# EAGLE design main_board (EAGLE 9.6.2)

## Sheet 1 of 2
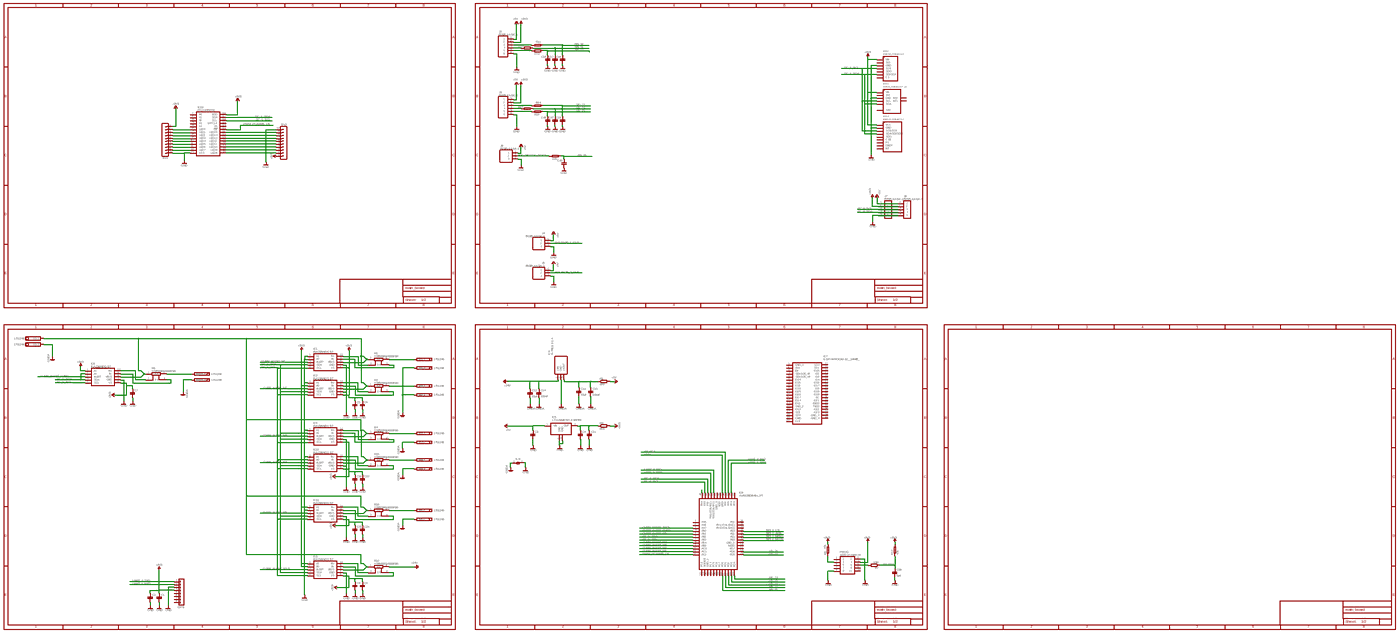
[diagram p0: schematic, sheet 1, overview]
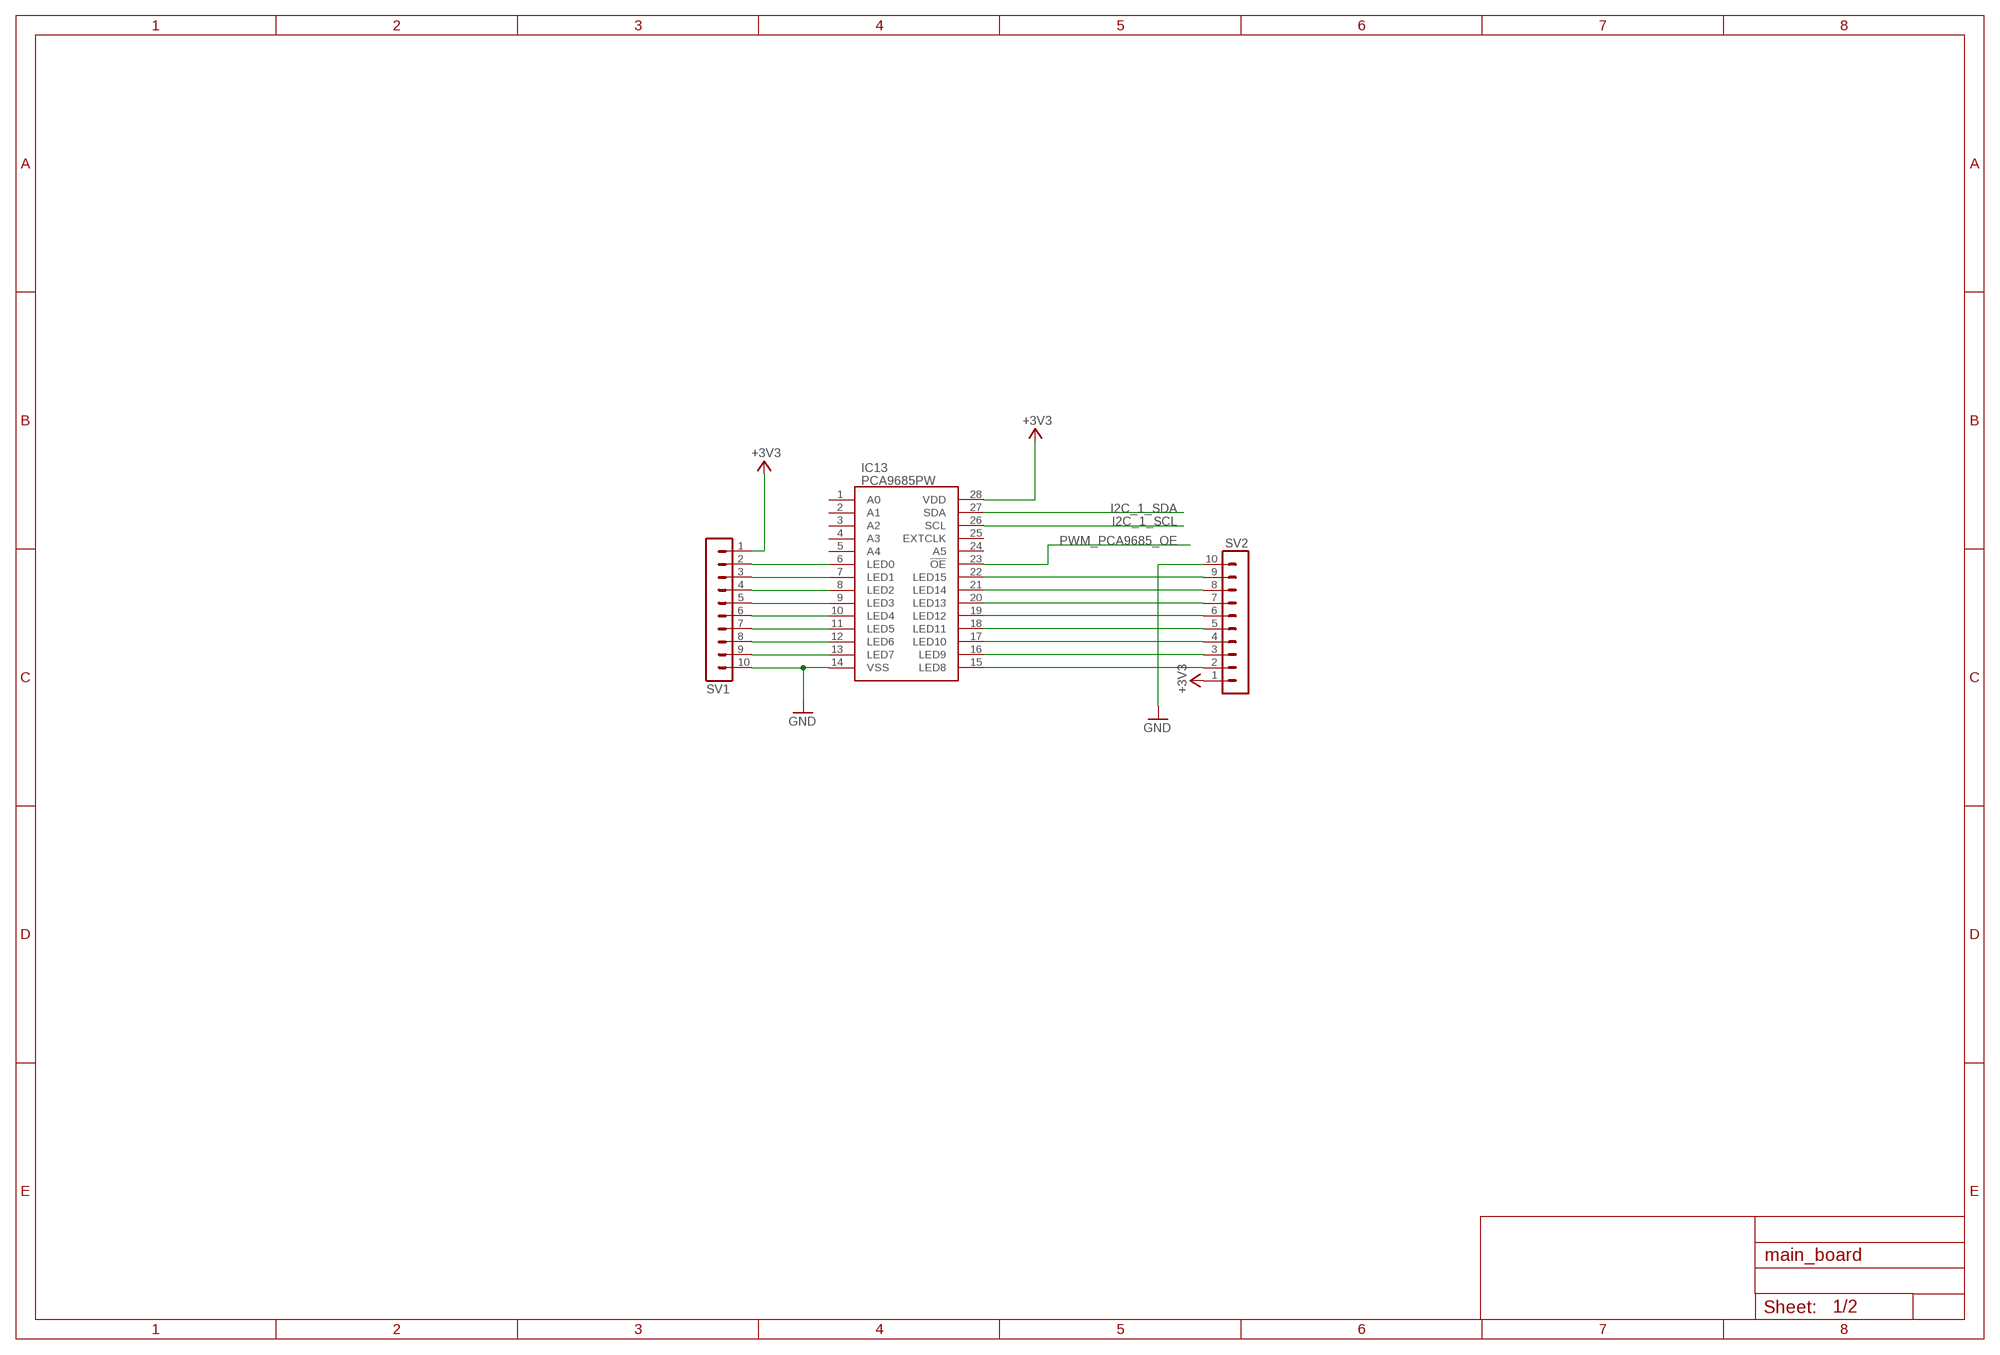
[diagram p1: schematic, sheet 1, part 1 of 7]
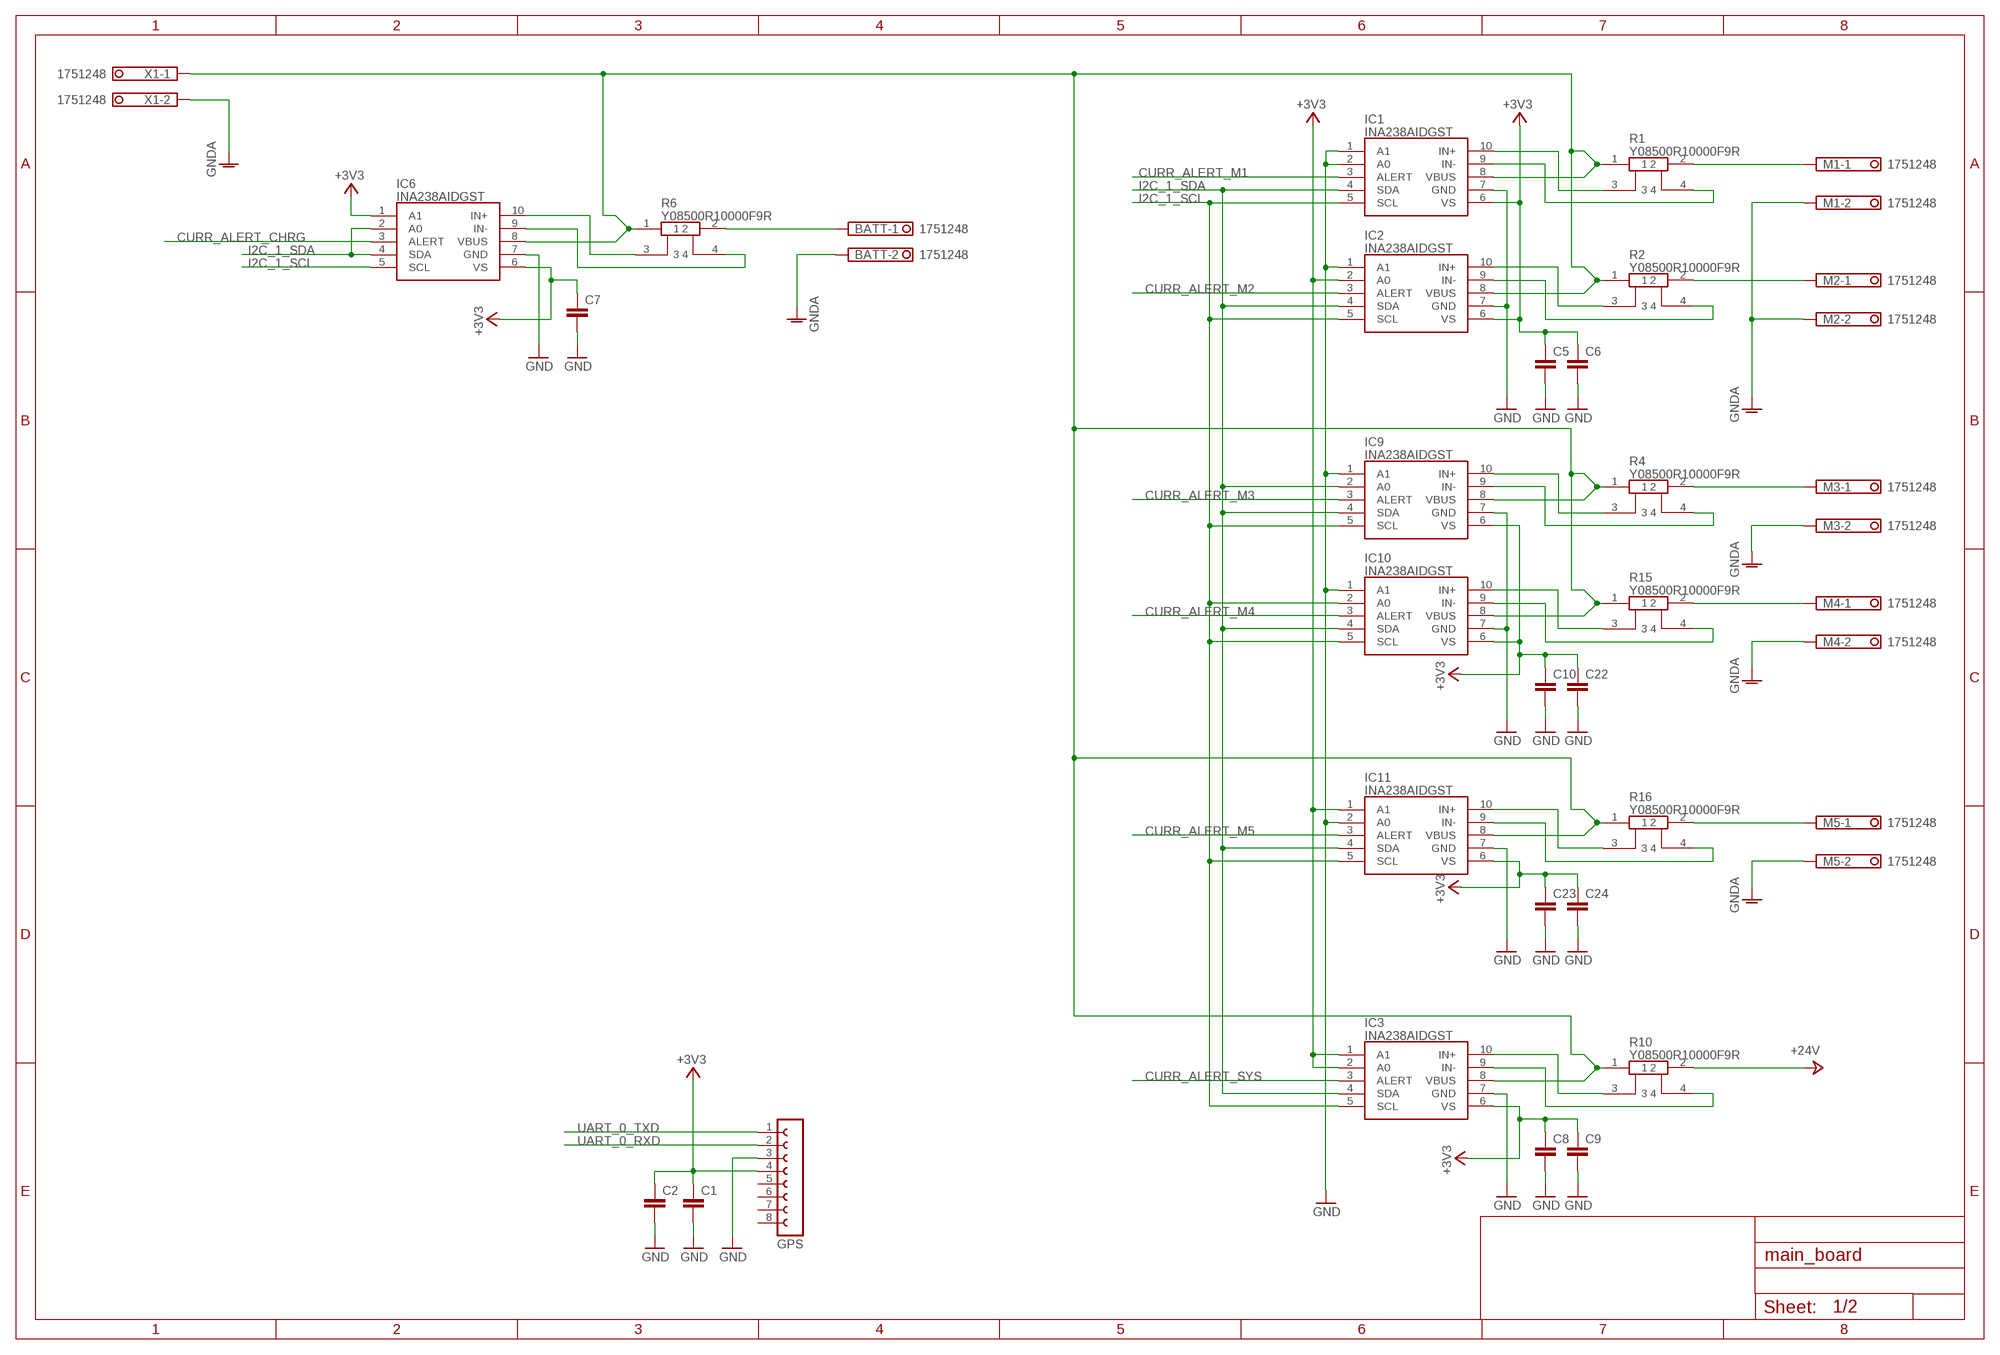
[diagram p2: schematic, sheet 1, part 2 of 7]
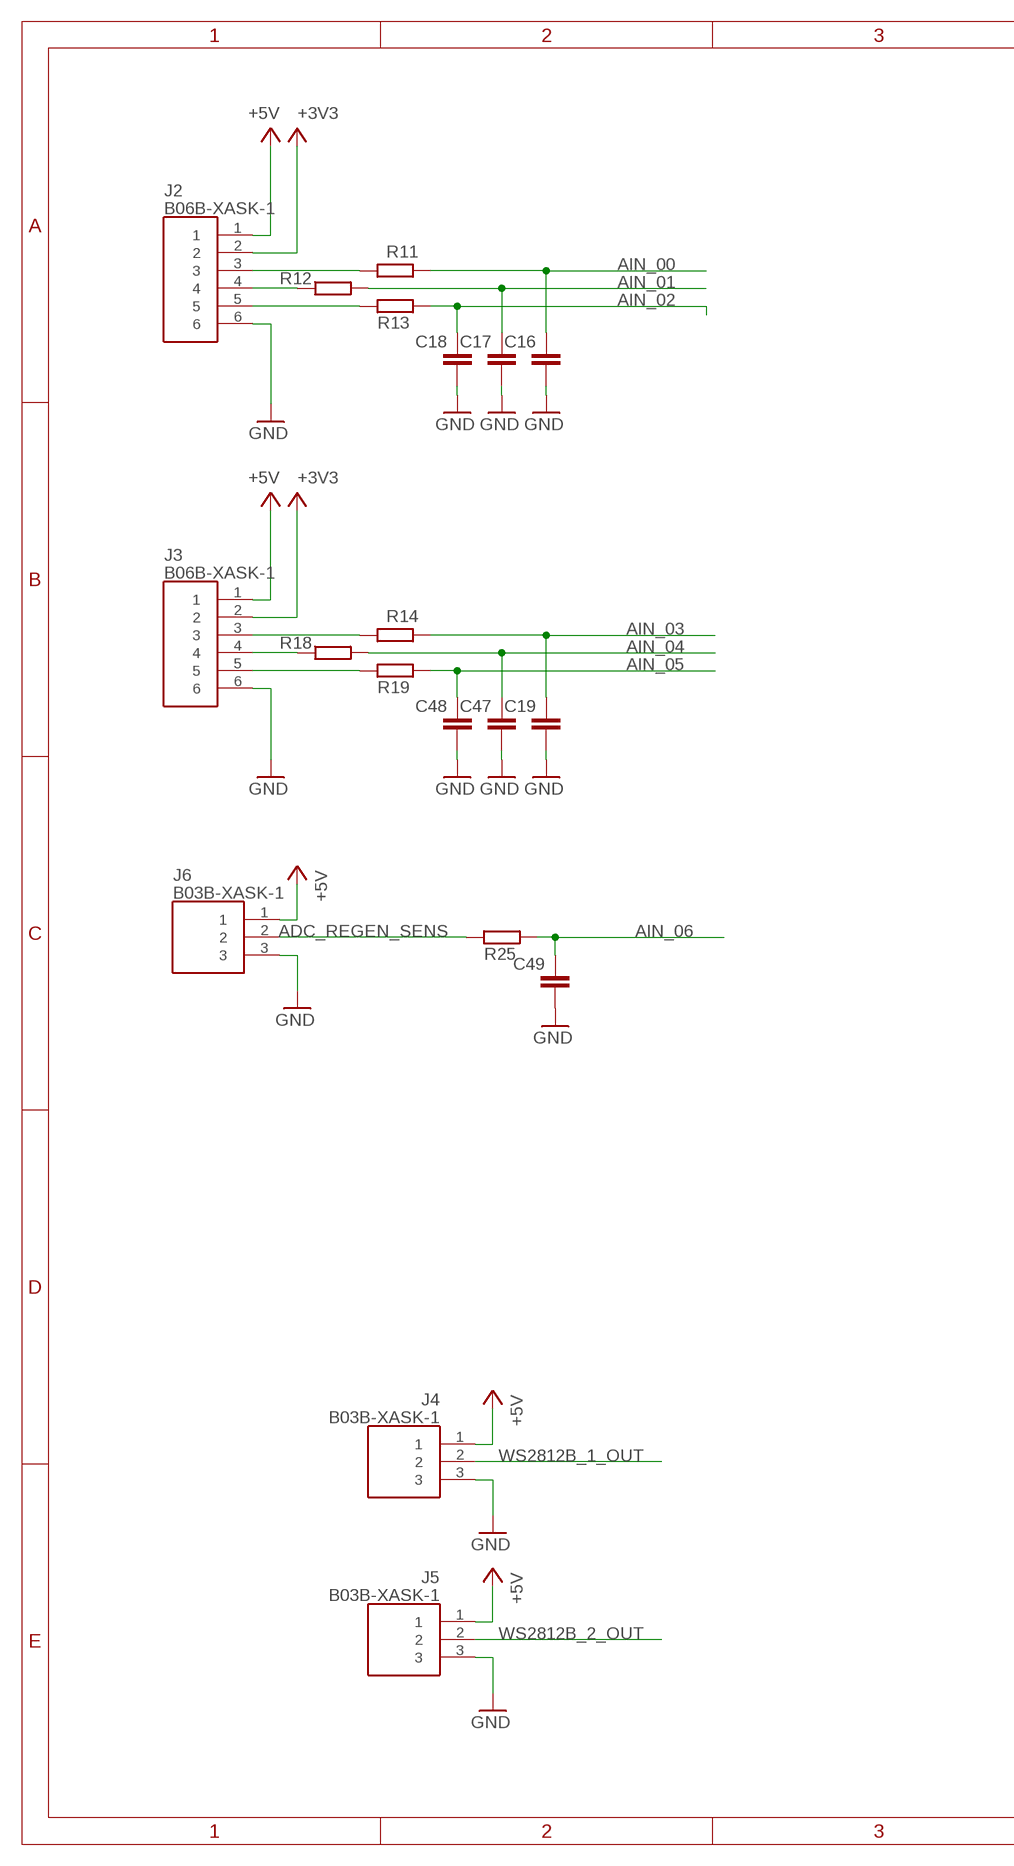
[diagram p3: schematic, sheet 1, part 3 of 7]
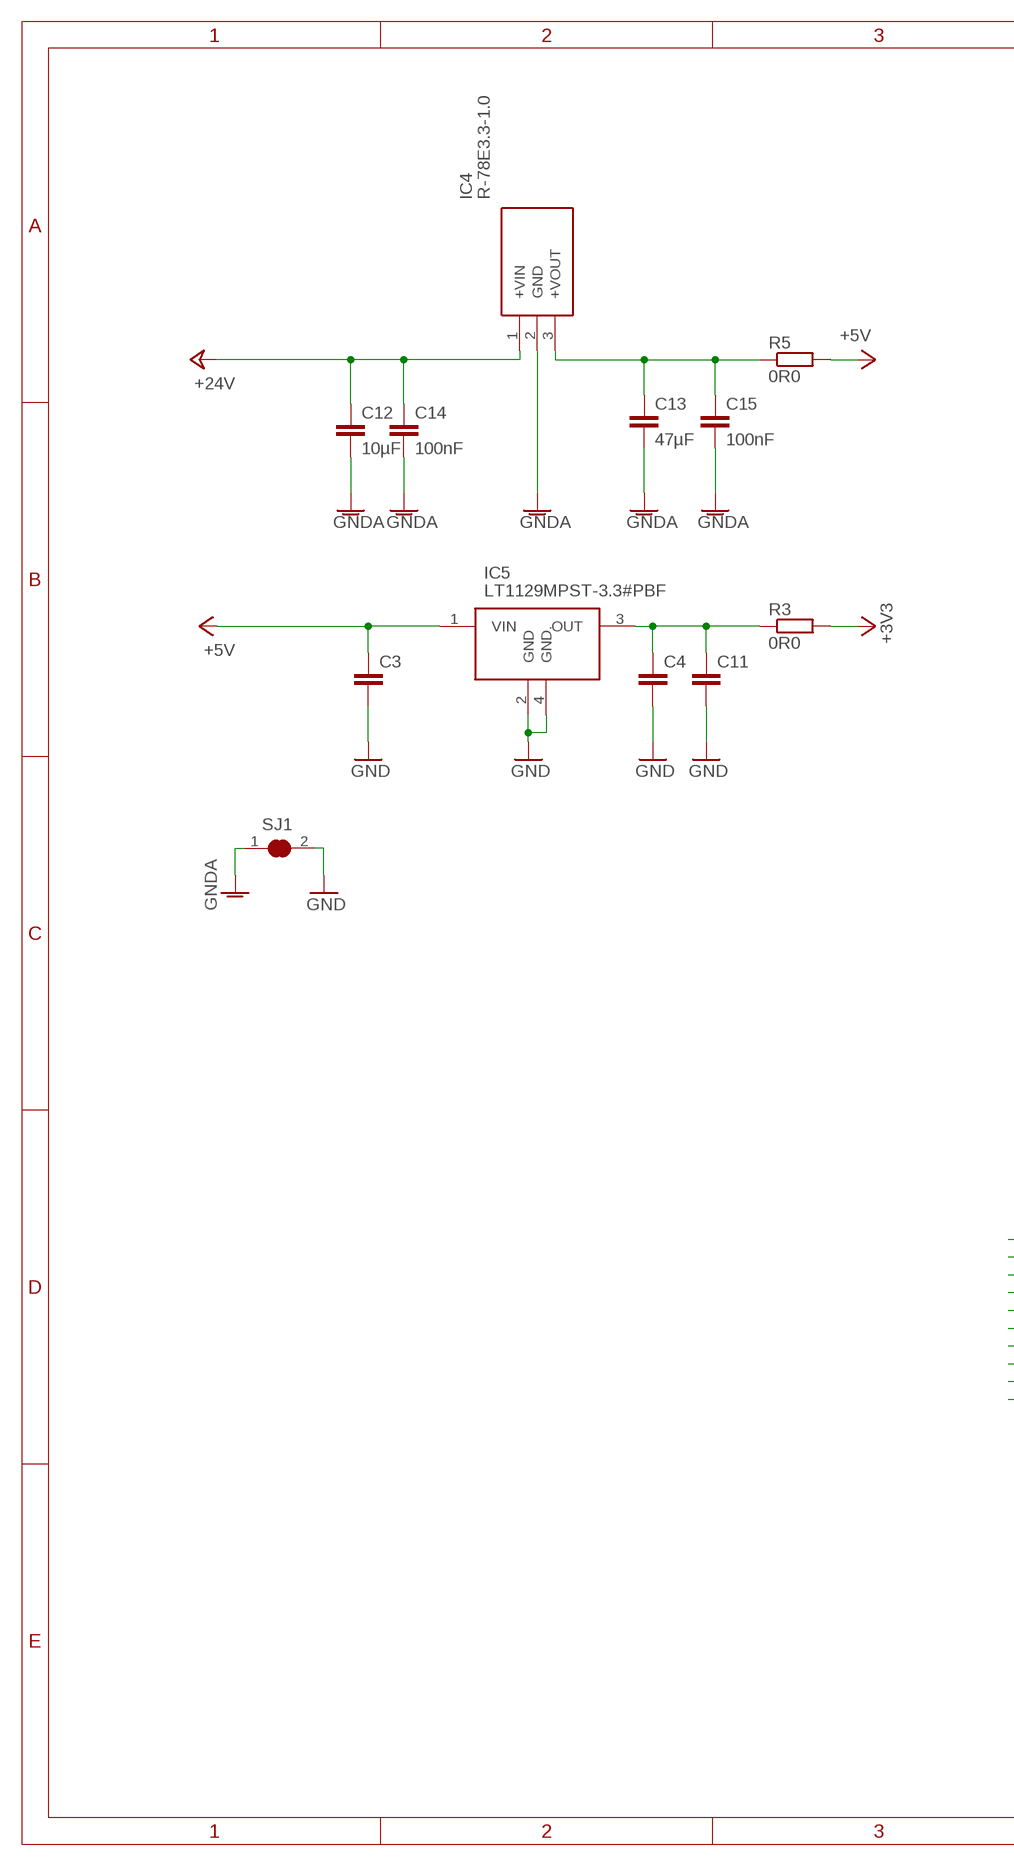
[diagram p4: schematic, sheet 1, part 4 of 7]
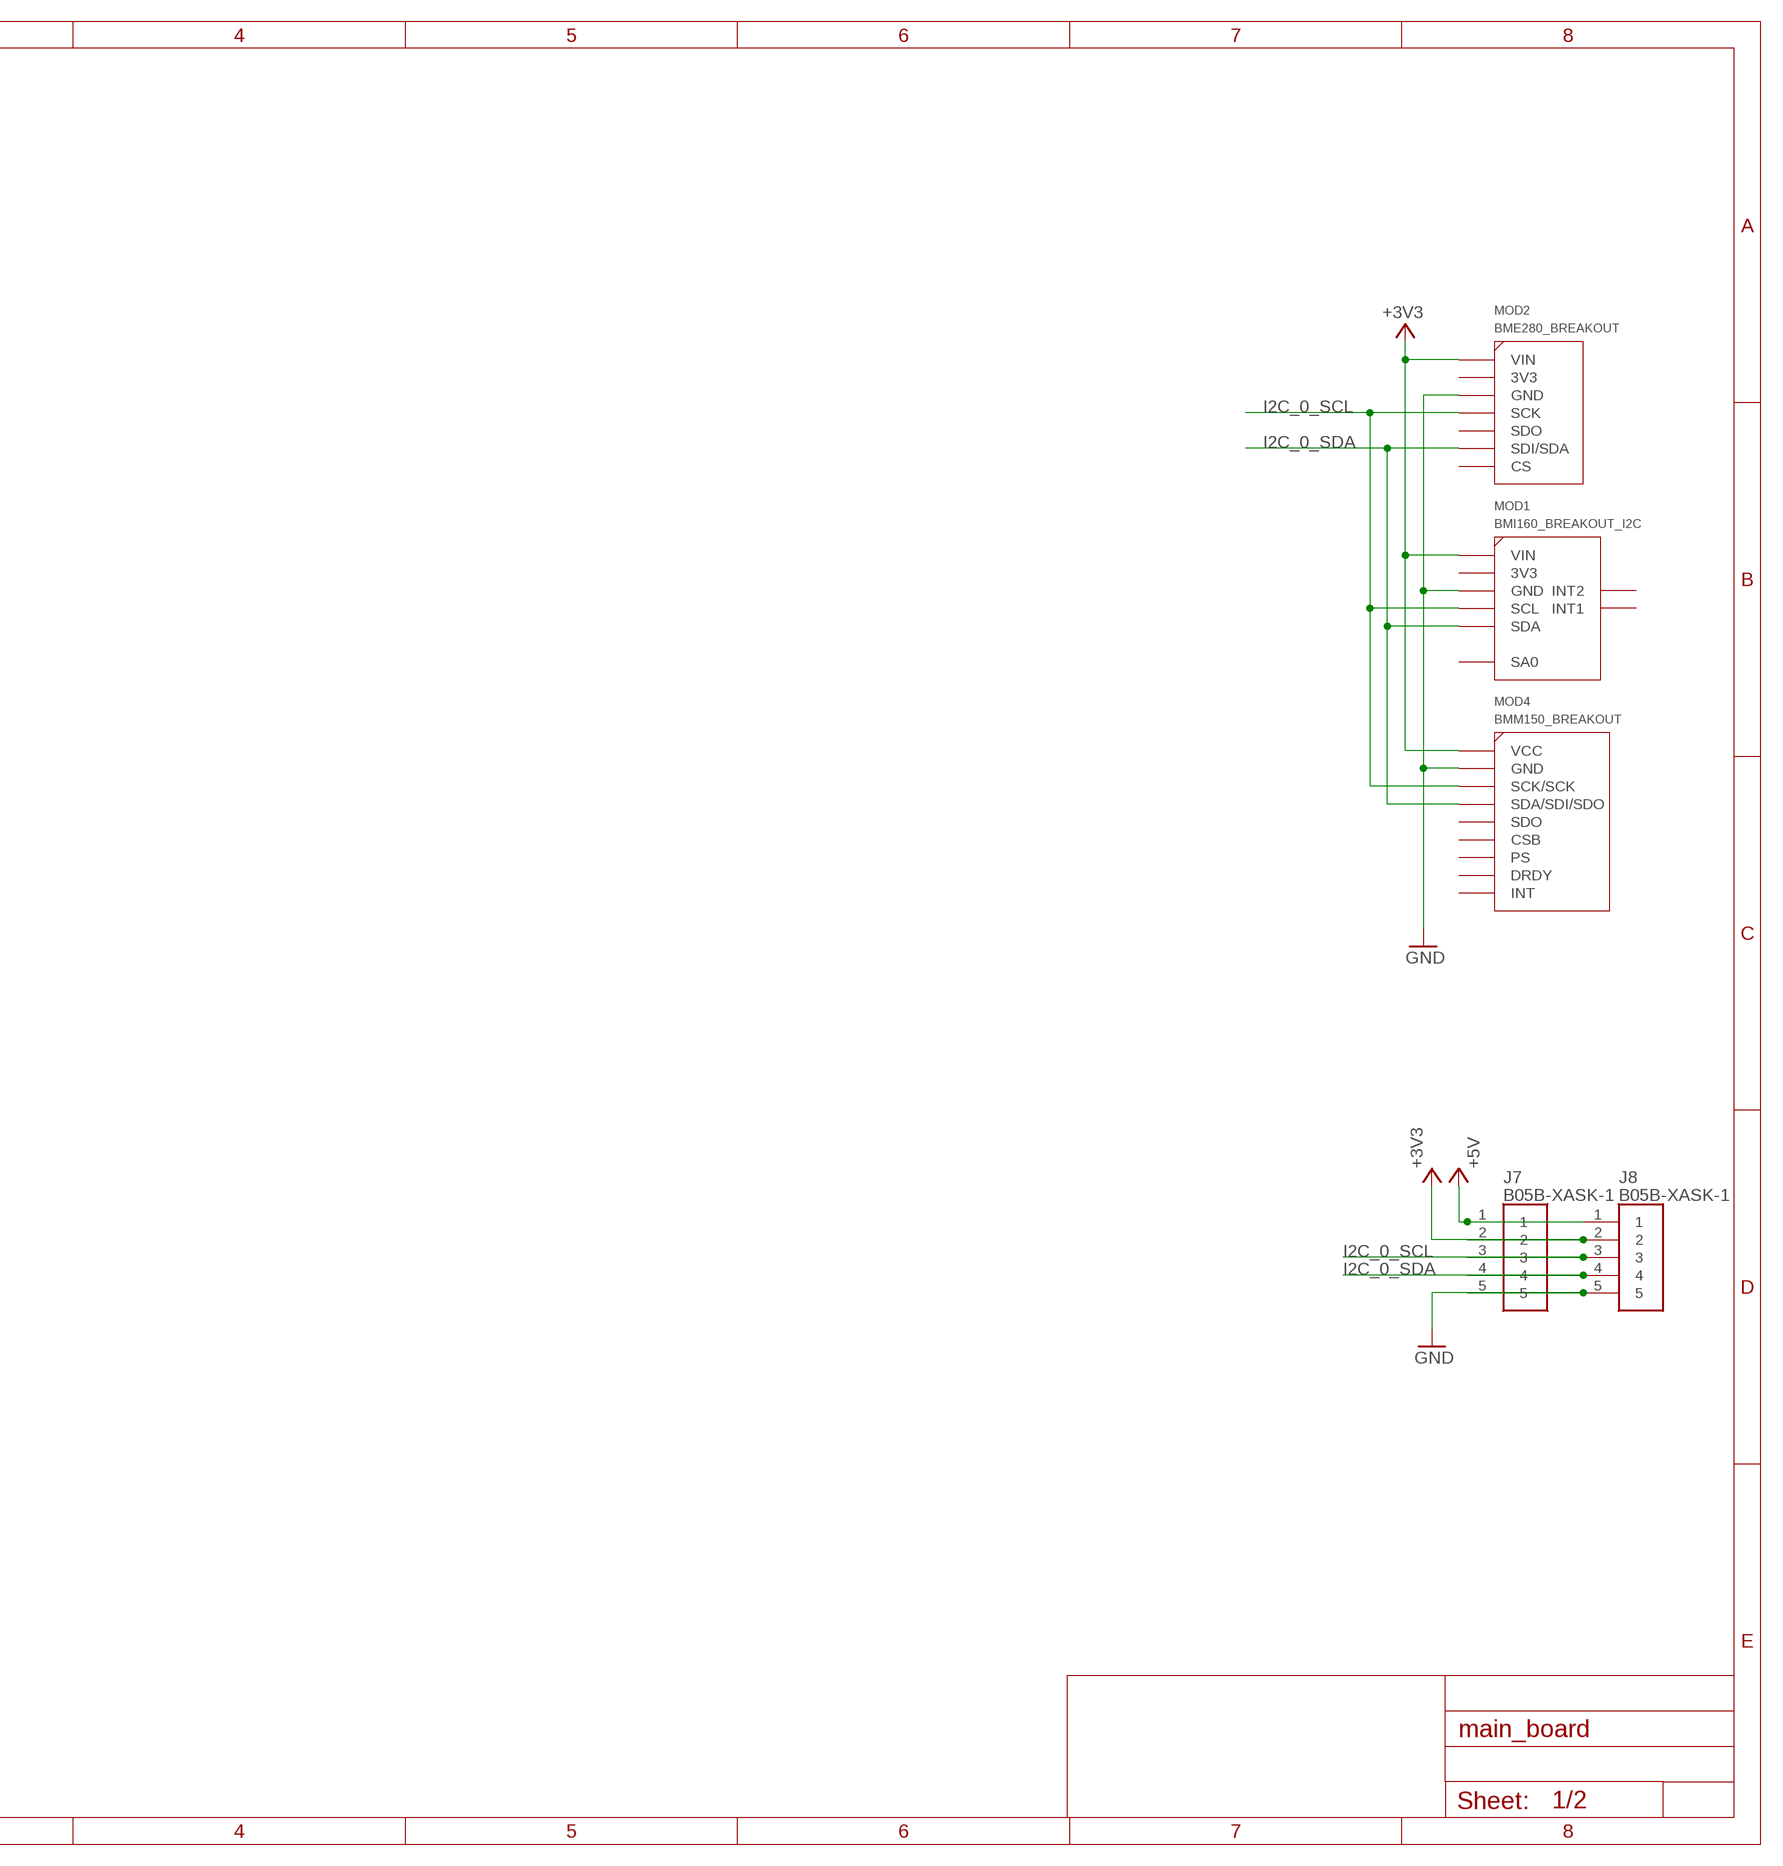
[diagram p5: schematic, sheet 1, part 5 of 7]
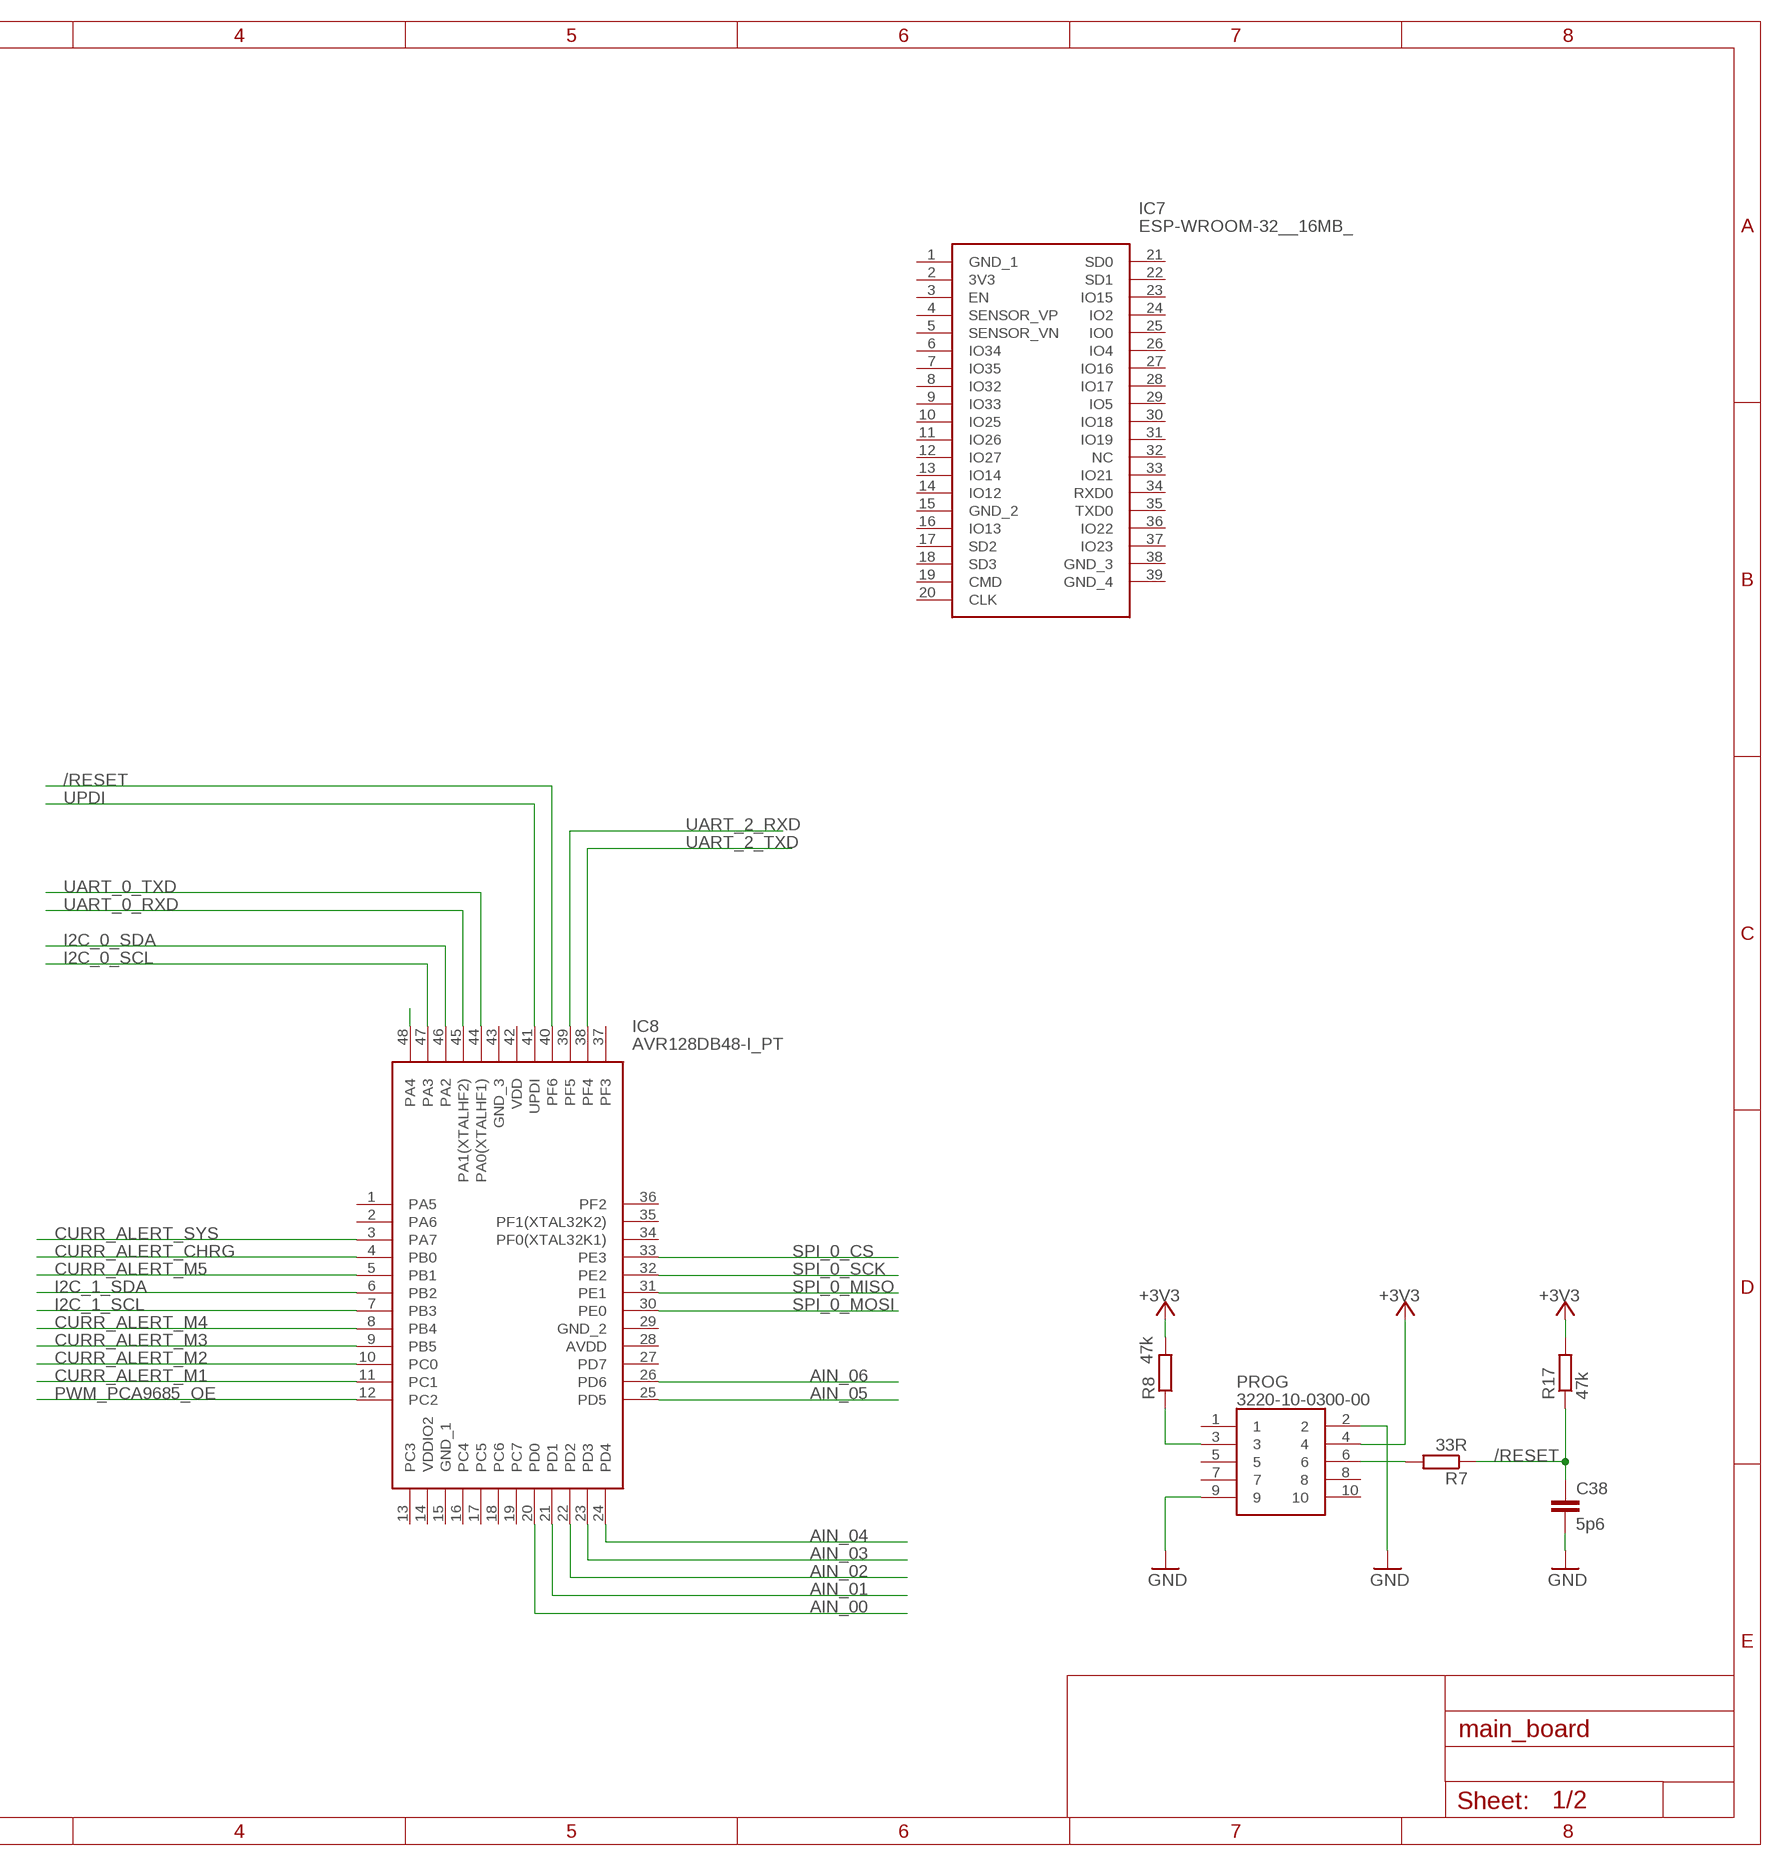
[diagram p6: schematic, sheet 1, part 6 of 7]
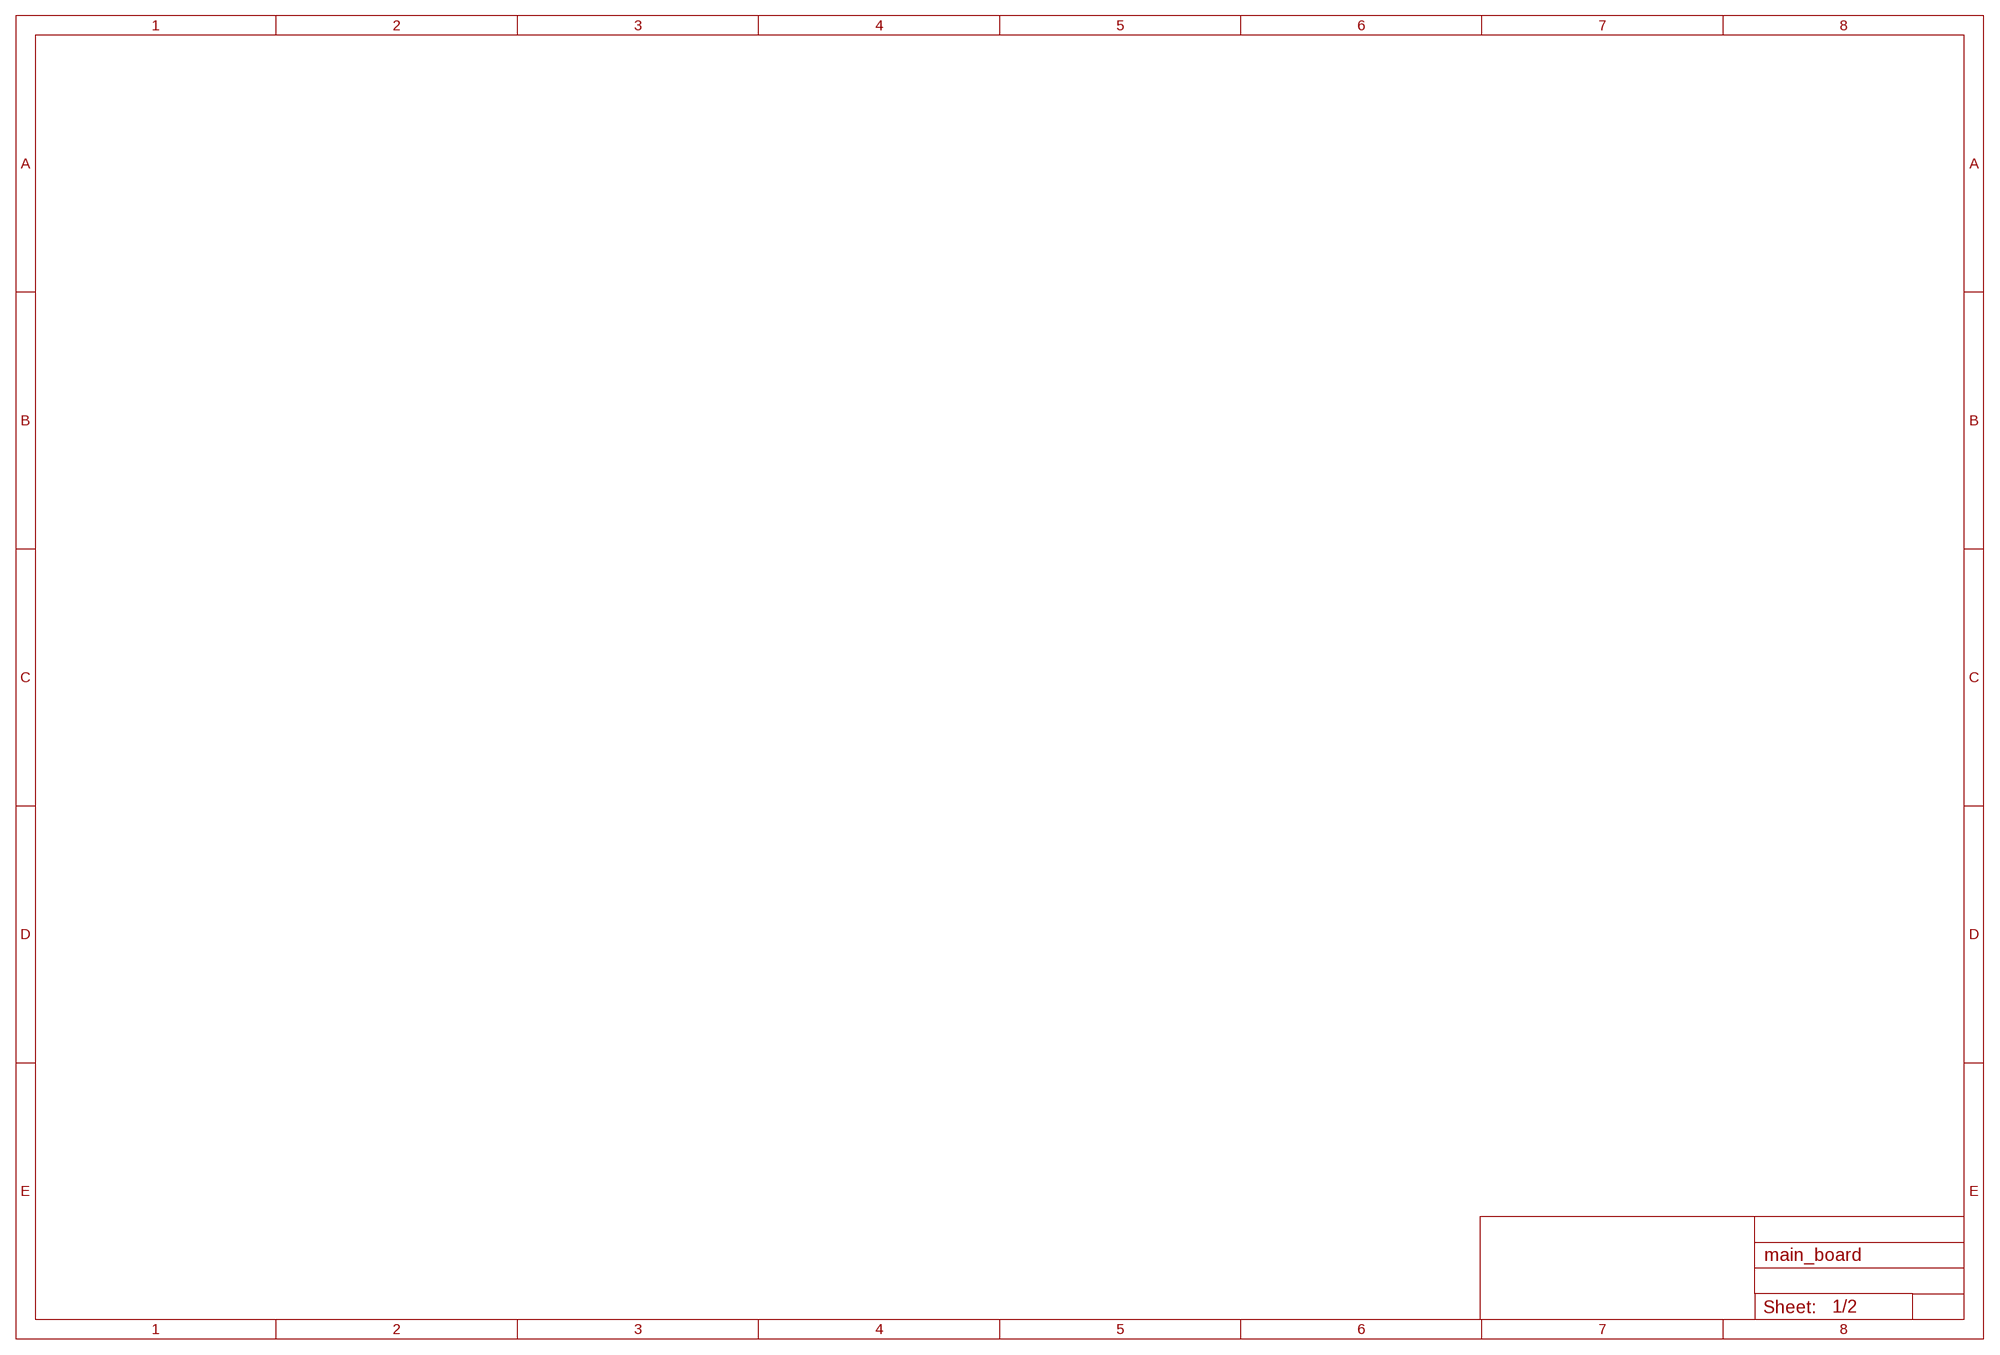
[diagram p7: schematic, sheet 1, part 7 of 7]

### Parts
BATT  1751248  [1751248]
C1  C-EUC0603  [C0603]
C2  C-EUC0603  [C0603]
C3  C-EUC0603  [C0603]
C4  C-EUC0603  [C0603]
C5  C-EUC0603  [C0603]
C6  C-EUC0603  [C0603]
C7  C-EUC0603  [C0603]
C8  C-EUC0603  [C0603]
C9  C-EUC0603  [C0603]
C10  C-EUC0603  [C0603]
C11  C-EUC0603  [C0603]
C12  10µF  C-EUC1210  [C1210]
C13  47µF  C-EUC1210  [C1210]
C14  100nF  C-EUC0603  [C0603]
C15  100nF  C-EUC0603  [C0603]
C16  C-EUC0603  [C0603]
C17  C-EUC0603  [C0603]
C18  C-EUC0603  [C0603]
C19  C-EUC0603  [C0603]
C22  C-EUC0603  [C0603]
C23  C-EUC0603  [C0603]
C24  C-EUC0603  [C0603]
C38  5p6  C-EUC0603  [C0603]
C47  C-EUC0603  [C0603]
C48  C-EUC0603  [C0603]
C49  C-EUC0603  [C0603]
GPS  FE08-1  [FE08]
IC1  INA238AIDGST  [SOP50P490X110-10N]
IC2  INA238AIDGST  [SOP50P490X110-10N]
IC3  INA238AIDGST  [SOP50P490X110-10N]
IC4  R-78E3.3-1.0  [R78E3310]
IC5  LT1129MPST-3.3#PBF  [SOT230P700X180-4N]
IC6  INA238AIDGST  [SOP50P490X110-10N]
IC7  ESP-WROOM-32__16MB_  [ESP32WROOM32D]
IC8  AVR128DB48-I_PT  [QFP50P900X900X120-48N]
IC9  INA238AIDGST  [SOP50P490X110-10N]
IC10  INA238AIDGST  [SOP50P490X110-10N]
IC11  INA238AIDGST  [SOP50P490X110-10N]
IC13  PCA9685PW  [SOP65P640X110-28N]
J2  B06B-XASK-1  [SHDR6W60P0X250_1X6_1750X640X88]
J3  B06B-XASK-1  [SHDR6W60P0X250_1X6_1750X640X88]
J4  B03B-XASK-1  [SHDR3W60P0X250_1X3_1000X640X88]
J5  B03B-XASK-1  [SHDR3W60P0X250_1X3_1000X640X88]
J6  B03B-XASK-1  [SHDR3W60P0X250_1X3_1000X640X88]
J7  B05B-XASK-1  [SHDR5W60P0X250_1X5_1500X640X88]
J8  B05B-XASK-1  [SHDR5W60P0X250_1X5_1500X640X88]
M1  1751248  [1751248]
M2  1751248  [1751248]
M3  1751248  [1751248]
M4  1751248  [1751248]
M5  1751248  [1751248]
MOD1  BMI160_BREAKOUT_I2C  [BMI160_BREAKOUT_I2C]
MOD2  BME280_BREAKOUT  [BME280_BREAKOUT]
MOD4  BMM150_BREAKOUT  [BMM150_BREAKOUT]
PROG  3220-10-0300-00  [3220-10-0300-00]
R1  Y08500R10000F9R  [Y08500R10000F9R]
R2  Y08500R10000F9R  [Y08500R10000F9R]
R3  0R0  R-EU_R0603  [R0603]
R4  Y08500R10000F9R  [Y08500R10000F9R]
R5  0R0  R-EU_R0603  [R0603]
R6  Y08500R10000F9R  [Y08500R10000F9R]
R7  33R  R-EU_R0603  [R0603]
R8  47k  R-EU_R0603  [R0603]
R10  Y08500R10000F9R  [Y08500R10000F9R]
R11  R-EU_R0603  [R0603]
R12  R-EU_R0603  [R0603]
R13  R-EU_R0603  [R0603]
R14  R-EU_R0603  [R0603]
R15  Y08500R10000F9R  [Y08500R10000F9R]
R16  Y08500R10000F9R  [Y08500R10000F9R]
R17  47k  R-EU_R0603  [R0603]
R18  R-EU_R0603  [R0603]
R19  R-EU_R0603  [R0603]
R25  R-EU_R0603  [R0603]
SJ1  SOLDERJUMPER_CLOSEDPERM  [SOLDERJUMPER_CLOSEDPERM]
SV1  MA10-1  [MA10-1]
SV2  MA10-1  [MA10-1]
X1  1751248  [1751248]

### Nets
+3V3: C1.1 C2.1 C5.1 C6.1 C7.1 C8.1 C9.1 C10.1 C22.1 C23.1 C24.1 GPS.4 IC1.6(VS) IC2.2(A0) IC2.6(VS) IC3.1(A1) IC3.2(A0) IC3.6(VS) IC6.1(A1) IC6.6(VS) IC9.6(VS) IC10.6(VS) IC11.1(A1) IC11.6(VS) IC13.28(VDD) J2.2 J3.2 J7.2 J8.2 MOD1.P$1(VIN) MOD2.P$1(VIN) MOD4.P$1(VCC) PROG.4 R3.2 R8.2 R17.2 SV1.1 SV2.1
+5V: C3.1 IC5.1(VIN) J2.1 J3.1 J4.1 J5.1 J6.1 J7.1 J8.1 R5.2
+24V: C12.1 C14.1 IC4.1(+VIN) R10.2
+24V2: IC1.8(VBUS) IC2.8(VBUS) IC3.8(VBUS) IC6.8(VBUS) IC9.8(VBUS) IC10.8(VBUS) IC11.8(VBUS) R1.1 R2.1 R4.1 R6.1 R10.1 R15.1 R16.1 X1.1
/RESET: C38.1 IC8.40(PF6) R7.1 R17.1
ADC_REGEN_SENS: J6.2 R25.1
AIN_00: C16.1 IC8.20(PD0) R11.2
AIN_01: C17.1 IC8.21(PD1) R12.2
AIN_02: C18.1 IC8.22(PD2) R13.2
AIN_03: C19.1 IC8.23(PD3) R14.2
AIN_04: C47.1 IC8.24(PD4) R18.2
AIN_05: C48.1 IC8.25(PD5) R19.2
AIN_06: C49.1 IC8.26(PD6) R25.2
CURR_ALERT_CHRG: IC6.3(ALERT) IC8.4(PB0)
CURR_ALERT_M1: IC1.3(ALERT) IC8.11(PC1)
CURR_ALERT_M2: IC2.3(ALERT) IC8.10(PC0)
CURR_ALERT_M3: IC8.9(PB5) IC9.3(ALERT)
CURR_ALERT_M4: IC8.8(PB4) IC10.3(ALERT)
CURR_ALERT_M5: IC8.5(PB1) IC11.3(ALERT)
CURR_ALERT_SYS: IC3.3(ALERT) IC8.3(PA7)
GND: C1.2 C2.2 C3.2 C4.2 C5.2 C6.2 C7.2 C8.2 C9.2 C10.2 C11.2 C16.2 C17.2 C18.2 C19.2 C22.2 C23.2 C24.2 C38.2 C47.2 C48.2 C49.2 GPS.3 IC1.1(A1) IC1.2(A0) IC1.7(GND) IC2.1(A1) IC2.7(GND) IC3.7(GND) IC5.2(GND) IC5.4(GND.) IC6.7(GND) IC9.1(A1) IC9.7(GND) IC10.1(A1) IC10.7(GND) IC11.2(A0) IC11.7(GND) IC13.14(VSS) J2.6 J3.6 J4.3 J5.3 J6.3 J7.5 J8.5 MOD1.P$3(GND) MOD2.P$3(GND) MOD4.P$2(GND) PROG.2 PROG.9 SJ1.2 SV1.10 SV2.10
GNDA: BATT.2 C12.2 C13.2 C14.2 C15.2 IC4.2(GND) M1.2 M2.2 M3.2 M4.2 M5.2 SJ1.1 X1.2
I2C_0_SCL: IC8.47(PA3) J7.3 J8.3 MOD1.P$4(SCL) MOD2.P$4(SCK) MOD4.P$3(SCK/SCK)
I2C_0_SDA: IC8.46(PA2) J7.4 J8.4 MOD1.P$5(SDA) MOD2.P$6(SDI/SDA) MOD4.P$4(SDA/SDI/SDO)
I2C_1_SCL: IC1.5(SCL) IC2.5(SCL) IC3.5(SCL) IC6.5(SCL) IC8.7(PB3) IC9.5(SCL) IC10.2(A0) IC10.5(SCL) IC11.5(SCL) IC13.26(SCL)
I2C_1_SDA: IC1.4(SDA) IC2.4(SDA) IC3.4(SDA) IC6.2(A0) IC6.4(SDA) IC8.6(PB2) IC9.2(A0) IC9.4(SDA) IC10.4(SDA) IC11.4(SDA) IC13.27(SDA)
N$1: M1.1 R1.2
N$2: M2.1 R2.2
N$3: M3.1 R4.2
N$4: C4.1 C11.1 IC5.3(OUT) R3.1
N$5: C13.1 C15.1 IC4.3(+VOUT) R5.1
N$6: IC2.9(IN-) R2.4
N$7: IC1.9(IN-) R1.4
N$8: IC1.10(IN+) R1.3
N$9: IC6.9(IN-) R6.4
N$10: IC2.10(IN+) R2.3
N$11: IC6.10(IN+) R6.3
N$12: BATT.1 R6.2
N$13: PROG.3 R8.1
N$14: IC13.15(LED8) SV2.2
N$15: J2.4 R12.1
N$16: PROG.6 R7.2
N$17: J2.5 R13.1
N$18: J2.3 R11.1
N$19: IC13.6(LED0) SV1.2
N$20: IC3.9(IN-) R10.4
N$21: IC3.10(IN+) R10.3
N$22: M4.1 R15.2
N$23: IC13.7(LED1) SV1.3
N$24: J3.4 R18.1
N$25: IC10.9(IN-) R15.4
N$26: J3.5 R19.1
N$27: IC9.9(IN-) R4.4
N$28: J3.3 R14.1
N$29: IC9.10(IN+) R4.3
N$30: IC13.8(LED2) SV1.4
N$31: IC10.10(IN+) R15.3
N$32: M5.1 R16.2
N$33: IC11.9(IN-) R16.4
N$34: IC11.10(IN+) R16.3
N$35: IC13.9(LED3) SV1.5
N$36: IC13.10(LED4) SV1.6
N$37: IC8.48(PA4)
N$38: IC13.11(LED5) SV1.7
N$40: IC13.12(LED6) SV1.8
N$41: IC13.13(LED7) SV1.9
N$42: IC13.16(LED9) SV2.3
N$43: IC13.17(LED10) SV2.4
N$44: IC13.18(LED11) SV2.5
N$45: IC13.19(LED12) SV2.6
N$46: IC13.20(LED13) SV2.7
N$47: IC13.21(LED14) SV2.8
N$48: IC13.22(LED15) SV2.9
PWM_PCA9685_OE: IC8.12(PC2) IC13.23(!OE)
SPI_0_CS: IC8.33(PE3)
SPI_0_MISO: IC8.31(PE1)
SPI_0_MOSI: IC8.30(PE0)
SPI_0_SCK: IC8.32(PE2)
UART_0_RXD: GPS.2 IC8.45(PA1(XTALHF2))
UART_0_TXD: GPS.1 IC8.44(PA0(XTALHF1))
UART_2_RXD: IC8.39(PF5)
UART_2_TXD: IC8.38(PF4)
UPDI: IC8.41(UPDI)
WS2812B_1_OUT: J4.2
WS2812B_2_OUT: J5.2
Unconnected: GPS.5 GPS.6 GPS.7 GPS.8 IC7.1(GND_1) IC7.2(3V3) IC7.3(EN) IC7.4(SENSOR_VP) IC7.5(SENSOR_VN) IC7.6(IO34) IC7.7(IO35) IC7.8(IO32) IC7.9(IO33) IC7.10(IO25) IC7.11(IO26) IC7.12(IO27) IC7.13(IO14) IC7.14(IO12) IC7.15(GND_2) IC7.16(IO13) IC7.17(SD2) IC7.18(SD3) IC7.19(CMD) IC7.20(CLK) IC7.21(SD0) IC7.22(SD1) IC7.23(IO15) IC7.24(IO2) IC7.25(IO0) IC7.26(IO4) IC7.27(IO16) IC7.28(IO17) IC7.29(IO5) IC7.30(IO18) IC7.31(IO19) IC7.32(NC) IC7.33(IO21) IC7.34(RXD0) IC7.35(TXD0) IC7.36(IO22) IC7.37(IO23) IC7.38(GND_3) IC7.39(GND_4) IC8.1(PA5) IC8.2(PA6) IC8.13(PC3) IC8.14(VDDIO2) IC8.15(GND_1) IC8.16(PC4) IC8.17(PC5) IC8.18(PC6) IC8.19(PC7) IC8.27(PD7) IC8.28(AVDD) IC8.29(GND_2) IC8.34(PF0(XTAL32K1)) IC8.35(PF1(XTAL32K2)) IC8.36(PF2) IC8.37(PF3) IC8.42(VDD) IC8.43(GND_3) IC13.1(A0) IC13.2(A1) IC13.3(A2) IC13.4(A3) IC13.5(A4) IC13.24(A5) IC13.25(EXTCLK) MOD1.P$2(3V3) MOD1.P$7(SA0) MOD1.P$9(INT2) MOD1.P$10(INT1) MOD2.P$2(3V3) MOD2.P$5(SDO) MOD2.P$7(CS) MOD4.P$5(SDO) MOD4.P$6(CSB) MOD4.P$7(PS) MOD4.P$8(DRDY) MOD4.P$9(INT) PROG.1 PROG.5 PROG.7 PROG.8 PROG.10

## Sheet 2 of 2
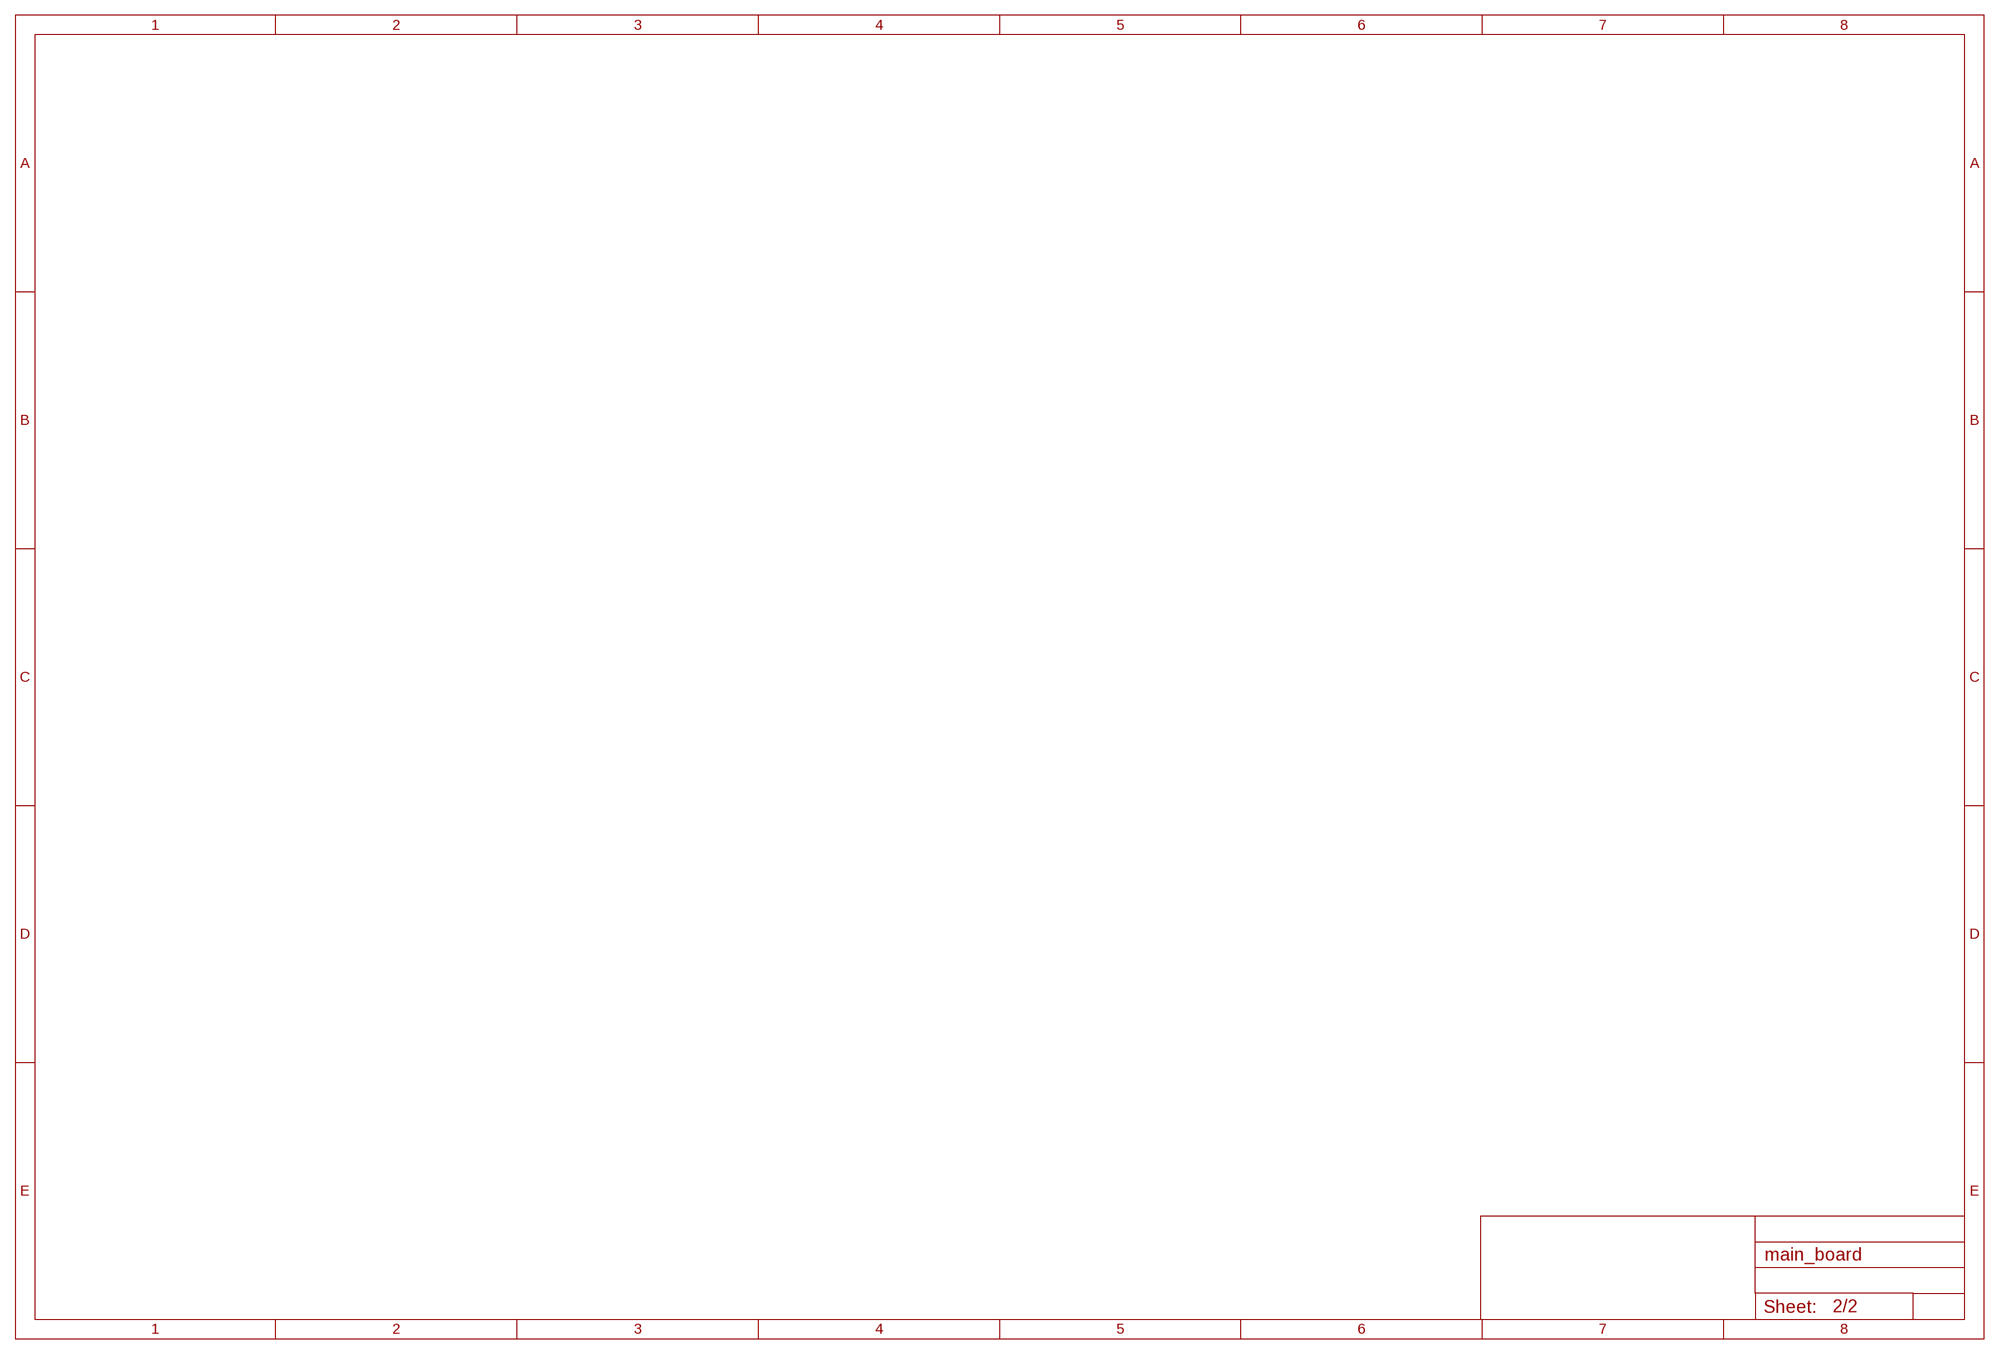
[diagram p8: schematic, sheet 2]

## Library data of the parts
BATT M1-M5 X1 = con-phoenix-350:1751248: MKDS 1/ 2-3,5 Printklemme Nennstrom: 10 A Bemessungsspannung: 160 V Raster: 3,5 mm Polzahl: 2 Montageart: Löten Anschlussart: Schraubanschluss Anschlussrichtung vom Leiter zur Platine: 0° Source: http://eshop.phoenixcontact.com .. 1751248.pdf; OC_FARNELL: unknown; OC_NEWARK: unknown
C1-C19 C22-C24 C38 C47-C49 = rcl:C-EU: CAPACITOR, European symbol; SPICEPREFIX: C
GPS = con-lsta:FE08-1: FEMALE HEADER; OC_FARNELL: unknown; OC_NEWARK: unknown
IC1-IC3 IC6 IC9-IC11 = SamacSys_Parts:INA238AIDGST: Analog to Digital Converters - ADC 85-V, 16-bit, high-precision I2C output current/voltage/power monitor with alert 10-VSSOP -40 to 125 Source: Datasheet <https://www.ti.com/lit/ds/symlink/ina238.pdf?ts=1619924491111&ref_url=https%3A%2F%2Fwww.ti.com%2Fproduct%2FINA238%3FHQS%3DTI-null-null-octopart-df-pf-null-wwe>; ARROW_PART_NUMBER: INA238AIDGST; ARROW_PRICE-STOCK: https://www.arrow.com/en/products/ina238aidgst/texas-instruments?region=nac; DESCRIPTION: Analog to Digital Converters - ADC 85-V, 16-bit, high-precision I2C output current/voltage/power monitor with alert 10-VSSOP -40 to 125; HEIGHT: 1.1mm; MANUFACTURER_NAME: Texas Instruments; MANUFACTURER_PART_NUMBER: INA238AIDGST; MOUSER_PART_NUMBER: 595-INA238AIDGST; MOUSER_PRICE-STOCK: https://www.mouser.co.uk/ProductDetail/Texas-Instruments/INA238AIDGST?qs=DRkmTr78QATCCZN2%2FktswA%3D%3D
IC4 = SamacSys_Parts:R-78E3.3-1.0: Recom DC-DC Switching Regulator, 7 28V dc Input, 3.3V Output, 1A Source: Datasheet <https://componentsearchengine.com/Datasheets/1/R-78E3.3-1.0.pdf>; ARROW_PART_NUMBER: R-78E3.3-1.0; ARROW_PRICE-STOCK: https://www.arrow.com/en/products/r-78e3.3-1.0/recom-power; DESCRIPTION: Recom DC-DC Switching Regulator, 7 28V dc Input, 3.3V Output, 1A; HEIGHT: 10.9mm; MANUFACTURER_NAME: RECOM Power; MANUFACTURER_PART_NUMBER: R-78E3.3-1.0; MOUSER_PART_NUMBER: 919-R-78E3.3-1.0; MOUSER_PRICE-STOCK: https://www.mouser.co.uk/ProductDetail/RECOM-Power/R-78E33-10/?qs=D0iH%252BVFiYPOgLjjtWWnV0Q%3D%3D
IC5 = SamacSys_Parts:LT1129MPST-3.3#PBF: LDO Voltage Regulators 700mA Micropower Low Dropout Regulator with Shutdown Source: Datasheet <https://www.analog.com/media/en/technical-documentation/data-sheets/112935ff.pdf>; DESCRIPTION: LDO Voltage Regulators 700mA Micropower Low Dropout Regulator with Shutdown; HEIGHT: 1.8mm; MANUFACTURER_NAME: Linear Technology; MANUFACTURER_PART_NUMBER: LT1129MPST-3.3#PBF; MOUSER_PART_NUMBER: 584-1129MPST-3.3PBF; MOUSER_PRICE-STOCK: https://www.mouser.com/Search/Refine.aspx?Keyword=584-1129MPST-3.3PBF
IC7 = SamacSys_Parts:ESP-WROOM-32__16MB_: WiFi Modules (802.11) SMD Module, ESP32-D0WDQ6, 128Mbits SPI flash, UART Mode Source: Datasheet <https://www.mouser.com/datasheet/2/891/esp-wroom-32_datasheet_en-1365813.pdf>; ARROW_PART_NUMBER: ESP-WROOM-32 (16MB); DESCRIPTION: WiFi Modules (802.11) SMD Module, ESP32-D0WDQ6, 128Mbits SPI flash, UART Mode; HEIGHT: 3.1mm; MANUFACTURER_NAME: Espressif; MANUFACTURER_PART_NUMBER: ESP-WROOM-32 (16MB); MOUSER_PART_NUMBER: 356-ESPWROOM3216MB
IC8 = SamacSys_Parts:AVR128DB48-I_PT: 8-bit Microcontrollers - MCU 128KB, TQFP48, 85C, 24MHz, 12b ADC, Comp, Opamp, MVIO, ZCD, DAC, UART, SPI, TWI Source: Datasheet <https://ww1.microchip.com/downloads/en/DeviceDoc/AVR128DB28-32-48-64-DataSheet-DS40002247A.pdf>; ARROW_PART_NUMBER: AVR128DB48-I/PT; ARROW_PRICE-STOCK: https://www.arrow.com/en/products/avr128db48-ipt/microchip-technology?region=nac; DESCRIPTION: 8-bit Microcontrollers - MCU 128KB, TQFP48, 85C, 24MHz, 12b ADC, Comp, Opamp, MVIO, ZCD, DAC, UART, SPI, TWI; HEIGHT: 1.2mm; MANUFACTURER_NAME: Microchip; MANUFACTURER_PART_NUMBER: AVR128DB48-I/PT; MOUSER_PART_NUMBER: 579-AVR128DB48-I/PT; MOUSER_PRICE-STOCK: https://www.mouser.co.uk/ProductDetail/Microchip-Technology-Atmel/AVR128DB48-I-PT?qs=vmHwEFxEFR8J6TEwJS0Zlw%3D%3D
IC13 = SamacSys_Parts:PCA9685PW: LED DRIVER, RGBA, 28-TSSOP Source: Datasheet <http://docs-asia.electrocomponents.com/webdocs/0f65/0900766b80f65101.pdf>; DESCRIPTION: LED DRIVER, RGBA, 28-TSSOP; HEIGHT: 1.1mm; MANUFACTURER_NAME: Nexperia; MANUFACTURER_PART_NUMBER: PCA9685PW; MOUSER_PART_NUMBER: N/A; MOUSER_PRICE-STOCK: https://www.mouser.com/Search/Refine.aspx?Keyword=N%2FA
J2 J3 = SamacSys_Parts:B06B-XASK-1: JST XA Series, 2.5mm Pitch 6 Way 1 Row Shrouded Straight PCB Header, Through Hole, Solder Termination Source: Datasheet <http://www.jst-mfg.com/product/pdf/eng/eXA1.pdf>; ARROW_PART_NUMBER: B06B-XASK-1 (LF)(SN); ARROW_PRICE-STOCK: https://www.arrow.com/en/products/b06b-xask-1-lf-sn/jst-manufacturing; DESCRIPTION: JST XA Series, 2.5mm Pitch 6 Way 1 Row Shrouded Straight PCB Header, Through Hole, Solder Termination; HEIGHT: 8.8mm; MANUFACTURER_NAME: JST (JAPAN SOLDERLESS TERMINALS); MANUFACTURER_PART_NUMBER: B06B-XASK-1 (LF)(SN)
J4-J6 = SamacSys_Parts:B03B-XASK-1: 3 WAY, 2.5MM PITCH, PCB HEADER, STRAIGHT JST XA Series, 2.5mm Pitch 3 Way 1 Row Straight PCB Header, Solder Termination, 3A Source: Datasheet <http://uk.rs-online.com/web/p/products/6027613>; DESCRIPTION: 3 WAY, 2.5MM PITCH, PCB HEADER, STRAIGHT JST XA Series, 2.5mm Pitch 3 Way 1 Row Straight PCB Header, Solder Termination, 3A; HEIGHT: 8.8mm; MANUFACTURER_NAME: JST (JAPAN SOLDERLESS TERMINALS); MANUFACTURER_PART_NUMBER: B03B-XASK-1 (LF)(SN)
J7 J8 = SamacSys_Parts:B05B-XASK-1: 5 WAY, 2.5MM PITCH, PCB HEADER, STRAIGHT JST XA Series, 2.5mm Pitch 5 Way 1 Row Shrouded Straight PCB Header, Through Hole, Solder Termination Source: Datasheet <http://uk.rs-online.com/web/p/products/6027679>; DESCRIPTION: 5 WAY, 2.5MM PITCH, PCB HEADER, STRAIGHT JST XA Series, 2.5mm Pitch 5 Way 1 Row Shrouded Straight PCB Header, Through Hole, Solder Termination; HEIGHT: 8.8mm; MANUFACTURER_NAME: JST (JAPAN SOLDERLESS TERMINALS); MANUFACTURER_PART_NUMBER: B05B-XASK-1 (LF)(SN)
MOD1 = SamacSys_Parts:BMI160_BREAKOUT_I2C
MOD2 = SamacSys_Parts:BME280_BREAKOUT
MOD4 = SamacSys_Parts:BMM150_BREAKOUT
PROG = SamacSys_Parts:3220-10-0300-00: IDC BOX HEADER 0.050 10 POS Source: Datasheet <http://cnctech.us/pdfs/3220-XX-0300-00.pdf>; DESCRIPTION: IDC BOX HEADER 0.050 10 POS; HEIGHT: mm; MANUFACTURER_NAME: CNC Tech; MANUFACTURER_PART_NUMBER: 3220-10-0300-00
R1 R2 R4 R6 R10 R15 R16 = SamacSys_Parts:Y08500R10000F9R: 100m Metal Foil Fixed Resistor +/-1% 0.5W Y08500R10000F9R Source: Datasheet <https://www.mouser.com/datasheet/2/428/vcs1625-11157.pdf>; ARROW_PART_NUMBER: Y08500R10000F9R; ARROW_PRICE-STOCK: https://www.arrow.com/en/products/y08500r10000f9r/vishay-precision-group; DESCRIPTION: 100m Metal Foil Fixed Resistor +/-1% 0.5W Y08500R10000F9R; HEIGHT: 1.02mm; MANUFACTURER_NAME: Vishay; MANUFACTURER_PART_NUMBER: Y08500R10000F9R; MOUSER_PART_NUMBER: 71-VCS16250R1000FST; MOUSER_PRICE-STOCK: https://www.mouser.co.uk/ProductDetail/Vishay-Precision-Group-Foil-Resistors/Y08500R10000F9R?qs=adduyb8LSTFkq2LaSAXrLg%3D%3D
R3 R5 R7 R8 R11-R14 R17-R19 R25 = rcl:R-EU_: RESISTOR, European symbol; SPICEPREFIX: R
SJ1 = microbuilder:SOLDERJUMPER_CLOSED: Solder Jumper - Closed These solder jumpers are closed by default CLOSEDWIRE - 10 mil trace between pads that can be cut and resoldered later CLOSEDPERM - 63 mil trace between pads for a permanent connection (used to 'bridge' two signals, a shameless hack for Eagle). Can double as a test point as well (no cream layer)
SV1 SV2 = con-lstb:MA10-1: PIN HEADER; OC_FARNELL: unknown; OC_NEWARK: unknown

## Board
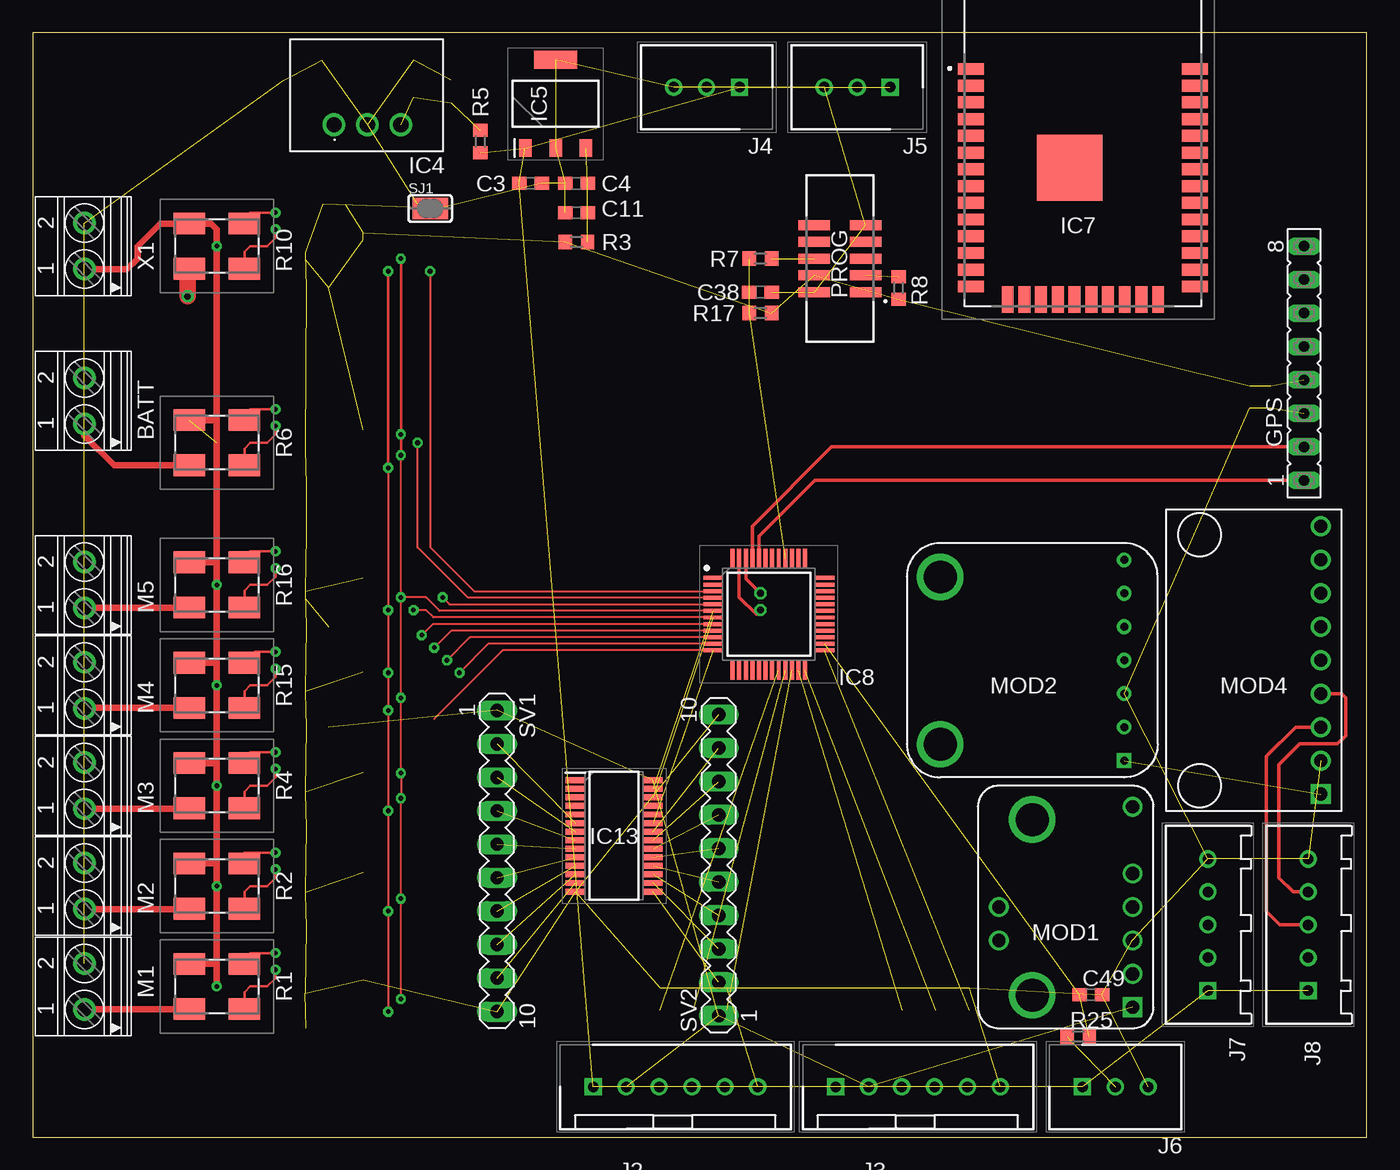
[diagram p9: board, top side]
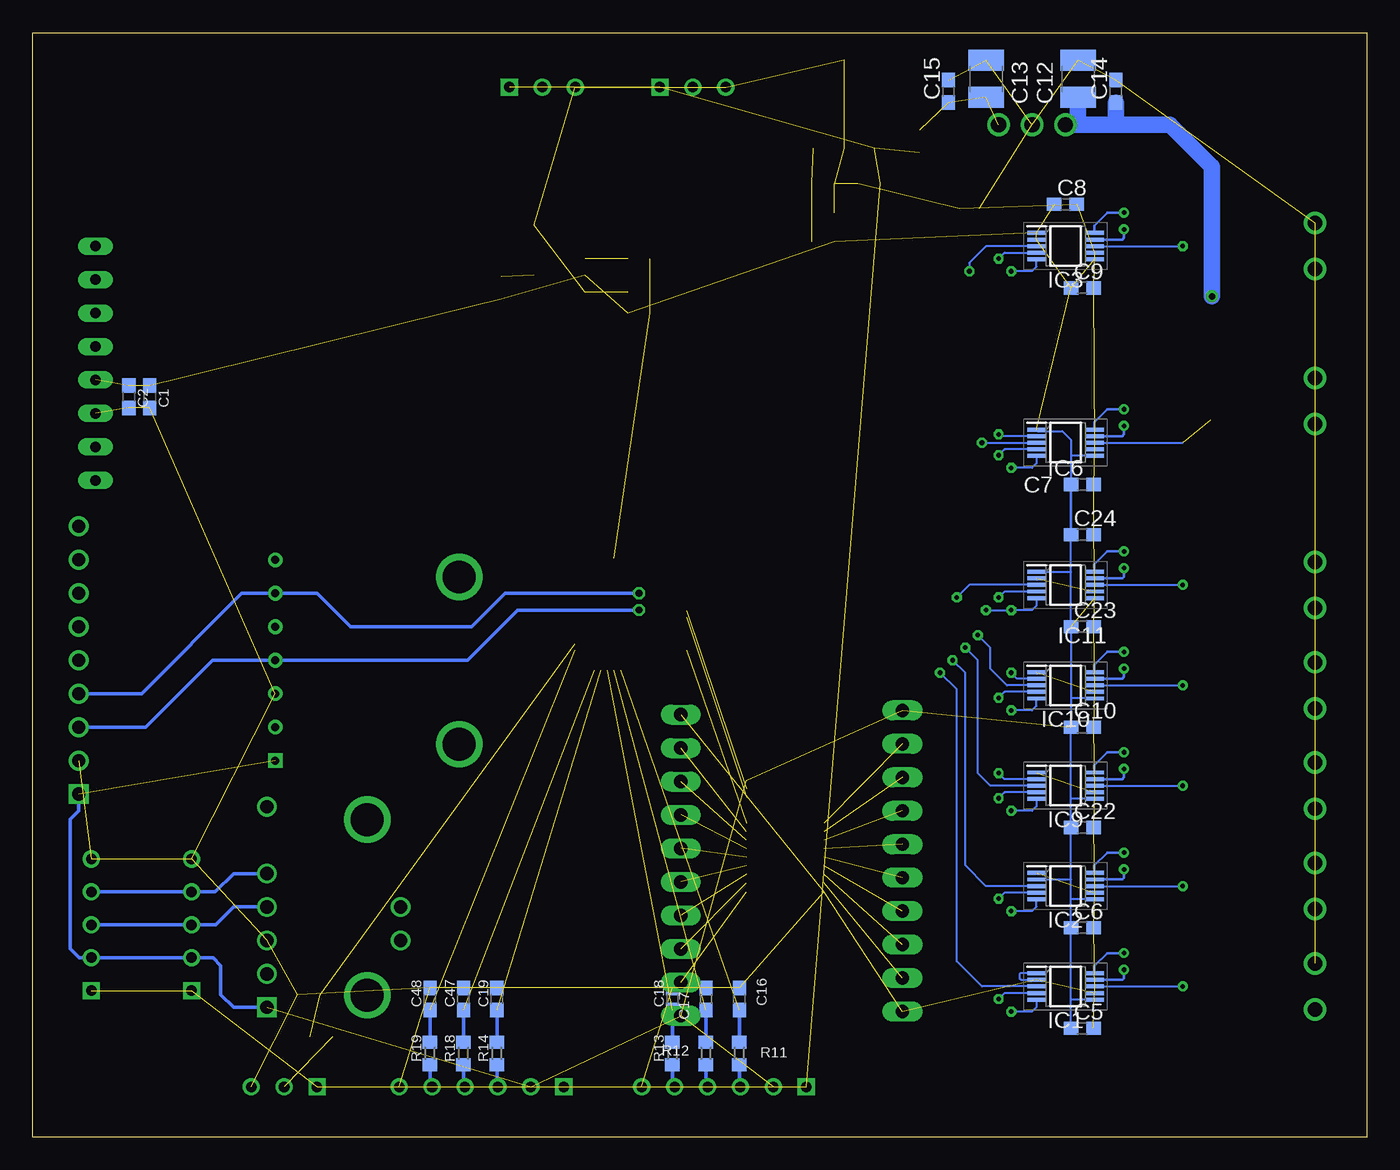
[diagram p10: board, bottom side, seen from below]

Size 101.27 x 83.81 mm. Coordinates in mm from the lower left corner, seen from the top.
Outline: 0,0 101.27,0 101.27,83.81 0,83.81 0,0
Copper layers (1*16): Top 0.035mm / dielectric 1.5mm / Bottom 0.035mm
Design rules "default": minimum track width 6mil, minimum drill 0.35mm, track to track 6mil, track to pad 6mil, pad to pad 6mil, via to via 6mil, smd to smd 6mil, copper to edge 40mil, drill to drill 6mil, minimum pad ring 10mil, minimum via ring 8mil, stop-mask expansion 4mil, vias tented up to drill 0mil, thermal gap 10mil

### Footprints (pad centres in the part's own frame; a part is rotated, then mirrored left to right if it is on the bottom)
1751248 = drill 1.1 pad 1.7: 1 -1.75,-0.1; 2 1.75,-0.1
C0603 = smd 1.1 x 1: 1 -0.85,0; 2 0.85,0
C1210 = smd 1.6 x 2.7: 1 -1.4,0; 2 1.4,0
FE08 = drill 0.813 long: 1 -8.89,0; 2 -6.35,0; 3 -3.81,0; 4 -1.27,0; 5 1.27,0; 6 3.81,0; 7 6.35,0; 8 8.89,0
SOP50P490X110-10N = smd 1.4 x 0.3: 1 -2.2,1; 2 -2.2,0.5; 3 -2.2,0; 4 -2.2,-0.5; 5 -2.2,-1; 6 2.2,-1; 7 2.2,-0.5; 8 2.2,0; 9 2.2,0.5; 10 2.2,1
R78E3310 = drill 1.15 pad 1.725: 1 0,0; 2 2.54,0; 3 5.08,0
SOT230P700X180-4N = smd 1.35 x 0.95: 1 -3.35,2.3; 2 -3.35,0; 3 -3.35,-2.3 | smd 1.35 x 3.25: 4 3.35,0
ESP32WROOM32D = smd 2 x 0.9: 1 -8.15,5.51; 2 -8.15,4.24; 3 -8.15,2.97; 4 -8.15,1.7; 5 -8.15,0.43; 6 -8.15,-0.84; 7 -8.15,-2.11; 8 -8.15,-3.38; 9 -8.15,-4.65; 10 -8.15,-5.92; 11 -8.15,-7.19; 12 -8.15,-8.46; 13 -8.15,-9.73; 14 -8.15,-11; 25 8.85,-11; 26 8.85,-9.73; 27 8.85,-8.46; 28 8.85,-7.19; 29 8.85,-5.92; 30 8.85,-4.65; 31 8.85,-3.38; 32 8.85,-2.11; 33 8.85,-0.84; 34 8.85,0.43; 35 8.85,1.7; 36 8.85,2.97; 37 8.85,4.24; 38 8.85,5.51 | smd 0.9 x 2: 15 -5.365,-12; 16 -4.095,-12; 17 -2.825,-12; 18 -1.555,-12; 19 -0.285,-12; 20 0.985,-12; 21 2.255,-12; 22 3.525,-12; 23 4.795,-12; 24 6.065,-12 | smd 5 x 5: 39 -0.65,-1.99
QFP50P900X900X120-48N = smd 1.475 x 0.3: 1 -4.238,2.75; 2 -4.238,2.25; 3 -4.238,1.75; 4 -4.238,1.25; 5 -4.238,0.75; 6 -4.238,0.25; 7 -4.238,-0.25; 8 -4.238,-0.75; 9 -4.238,-1.25; 10 -4.238,-1.75; 11 -4.238,-2.25; 12 -4.238,-2.75; 25 4.238,-2.75; 26 4.238,-2.25; 27 4.238,-1.75; 28 4.238,-1.25; 29 4.238,-0.75; 30 4.238,-0.25; 31 4.238,0.25; 32 4.238,0.75; 33 4.238,1.25; 34 4.238,1.75; 35 4.238,2.25; 36 4.238,2.75 | smd 0.3 x 1.475: 13 -2.75,-4.238; 14 -2.25,-4.238; 15 -1.75,-4.238; 16 -1.25,-4.238; 17 -0.75,-4.238; 18 -0.25,-4.238; 19 0.25,-4.238; 20 0.75,-4.238; 21 1.25,-4.238; 22 1.75,-4.238; 23 2.25,-4.238; 24 2.75,-4.238; 37 2.75,4.238; 38 2.25,4.238; 39 1.75,4.238; 40 1.25,4.238; 41 0.75,4.238; 42 0.25,4.238; 43 -0.25,4.238; 44 -0.75,4.238; 45 -1.25,4.238; 46 -1.75,4.238; 47 -2.25,4.238; 48 -2.75,4.238
SOP65P640X110-28N = smd 1.475 x 0.45: 1 -2.938,4.225; 2 -2.938,3.575; 3 -2.938,2.925; 4 -2.938,2.275; 5 -2.938,1.625; 6 -2.938,0.975; 7 -2.938,0.325; 8 -2.938,-0.325; 9 -2.938,-0.975; 10 -2.938,-1.625; 11 -2.938,-2.275; 12 -2.938,-2.925; 13 -2.938,-3.575; 14 -2.938,-4.225; 15 2.938,-4.225; 16 2.938,-3.575; 17 2.938,-2.925; 18 2.938,-2.275; 19 2.938,-1.625; 20 2.938,-0.975; 21 2.938,-0.325; 22 2.938,0.325; 23 2.938,0.975; 24 2.938,1.625; 25 2.938,2.275; 26 2.938,2.925; 27 2.938,3.575; 28 2.938,4.225
SHDR6W60P0X250_1X6_1750X640X88 = drill 0.8 pad 1.2 square: 1 0,0 | drill 0.8 pad 1.2: 2 -2.5,0; 3 -5,0; 4 -7.5,0; 5 -10,0; 6 -12.5,0
SHDR3W60P0X250_1X3_1000X640X88 = drill 0.8 pad 1.2 square: 1 0,0 | drill 0.8 pad 1.2: 2 -2.5,0; 3 -5,0
SHDR5W60P0X250_1X5_1500X640X88 = drill 0.8 pad 1.2 square: 1 0,0 | drill 0.8 pad 1.2: 2 -2.5,0; 3 -5,0; 4 -7.5,0; 5 -10,0
BMI160_BREAKOUT_I2C = drill 1 square: P$1 -5.08,7.62 | drill 1: P$2 -5.08,5.08; P$3 -5.08,2.54; P$4 -5.08,0; P$5 -5.08,-2.54; P$7 -5.08,-7.62; P$9 5.08,2.54; P$10 5.08,0 | drill 2.5: P$6 2.54,-6.636; P$61 2.54,6.699
BME280_BREAKOUT = drill 0.6 square: P$1 -7.62,7.62 | drill 0.6: P$2 -7.62,5.08; P$3 -7.62,2.54; P$4 -7.62,0; P$5 -7.62,-2.54; P$6 -7.62,-5.08; P$7 -7.62,-7.62 | drill 2.5: P$8 6.35,-6.318; P$61 6.35,6.382
BMM150_BREAKOUT = drill 1 square: P$1 -5.08,10.16 | drill 1: P$2 -5.08,7.62; P$3 -5.08,5.08; P$4 -5.08,2.54; P$5 -5.08,0; P$6 -5.08,-2.54; P$7 -5.08,-5.08; P$8 -5.08,-7.62; P$9 -5.08,-10.16
3220-10-0300-00 = smd 0.76 x 2.4: 1 -2.54,-1.95; 2 -2.54,1.95; 3 -1.27,-1.95; 4 -1.27,1.95; 5 0,-1.95; 6 0,1.95; 7 1.27,-1.95; 8 1.27,1.95; 9 2.54,-1.95; 10 2.54,1.95
Y08500R10000F9R = smd 2.41 x 1.65: 1 -2.095,1.715; 2 -2.095,-1.715; 3 2.095,1.715; 4 2.095,-1.715
R0603 = smd 1 x 1.1: 1 -0.85,0; 2 0.85,0
SOLDERJUMPER_CLOSEDPERM = smd 1.168 x 1.6: 1 -0.762,0; 2 0.762,0 | smd 0.635 x 1.6: WIRE 0,0
MA10-1 = drill 1.016 long: 1 -11.43,0; 2 -8.89,0; 3 -6.35,0; 4 -3.81,0; 5 -1.27,0; 6 1.27,0; 7 3.81,0; 8 6.35,0; 9 8.89,0; 10 11.43,0

### Placement (x,y rotation side)
BATT  3.81,55.88 90 top
C1  92.39,56.2 270 bottom
C2  93.98,56.2 270 bottom
C3  37.78,72.39 0 top
C4  41.27,72.39 180 top
C5  21.59,8.26 0 bottom
C6  21.59,15.88 0 bottom
C7  21.59,49.53 0 bottom
C8  22.86,70.8 0 bottom
C9  21.59,64.45 0 bottom
C10  21.59,31.11 0 bottom
C11  41.27,70.17 180 top
C12  21.91,80.33 90 bottom
C13  28.89,80.33 90 bottom
C14  19.05,79.38 90 bottom
C15  31.75,79.38 90 bottom
C16  47.62,10.48 90 bottom
C17  50.16,10.48 90 bottom
C18  52.7,10.48 90 bottom
C19  66.04,10.48 90 bottom
C22  21.59,23.5 0 bottom
C23  21.59,38.73 0 bottom
C24  21.59,45.72 0 bottom
C38  55.24,64.14 0 top
C47  68.58,10.48 90 bottom
C48  71.12,10.48 90 bottom
C49  80.33,10.79 0 top
GPS  96.52,58.74 90 top
IC1  22.86,11.43 0 bottom
IC2  22.86,19.05 0 bottom
IC3  22.86,67.63 0 bottom
IC4  22.86,76.83 0 top
IC5  39.69,78.42 90 top
IC6  22.86,52.7 0 bottom
IC7  79.38,75.56 0 top
IC8  55.88,39.69 0 top
IC9  22.86,26.67 0 bottom
IC10  22.86,34.29 0 bottom
IC11  22.86,41.91 0 bottom
IC13  44.13,22.86 0 top
J2  42.55,3.81 180 top
J3  60.96,3.81 180 top
J4  53.66,79.69 0 top
J5  65.09,79.69 0 top
J6  79.69,3.81 180 top
J7  89.22,11.11 270 top
J8  96.84,11.11 270 top
M1  3.81,11.43 90 top
M2  3.81,19.05 90 top
M3  3.81,26.67 90 top
M4  3.81,34.29 90 top
M5  3.81,41.91 90 top
MOD1  78.42,17.46 180 top
MOD2  75.25,36.2 180 top
MOD4  92.71,36.2 180 top
PROG  61.28,66.67 90 top
R1  13.97,11.43 0 top
R2  13.97,19.05 0 top
R3  41.27,67.94 180 top
R4  13.97,26.67 0 top
R5  33.97,75.56 270 top
R6  13.97,52.7 0 top
R7  55.24,66.67 0 top
R8  65.72,64.45 270 top
R10  13.97,67.63 0 top
R11  47.62,6.35 90 bottom
R12  50.16,6.35 90 bottom
R13  52.7,6.35 90 bottom
R14  66.04,6.35 90 bottom
R15  13.97,34.29 0 top
R16  13.97,41.91 0 top
R17  55.24,62.55 0 top
R18  68.58,6.35 90 bottom
R19  71.12,6.35 90 bottom
R25  79.38,7.62 0 top
SJ1  30.16,70.48 0 top
SV1  35.24,20.95 270 top
SV2  52.07,20.64 90 top
X1  3.81,67.63 90 top

### Tracks (layer width: path | path; a pad name or v marks a point on that pad's centre or on a via)
+3V3  (20 unrouted)
  Bottom 0.152: 22.44,42.91 C23.1 22.44,33.29 | 22.44,42.91 C24.1 | 22.44,33.29 C10.1 22.44,25.67 | C5.1 22.44,10.43 | 22.44,10.43 C6.1 22.44,18.05 | 22.44,18.05 22.44,19.55 | 22.44,19.55 C22.1 22.44,25.67 | IC9.6 22.44,25.67 | IC10.6 22.44,33.29 | IC2.6 22.44,18.05 | IC1.6 22.44,10.43 | C24.1 C7.1 | 22.44,51.7 22.44,52.92 23.1,53.58 24.94,53.58 IC6.1 | 22.44,51.7 C24.1 | IC6.6 22.44,51.7 | IC11.1 22.44,42.91 | IC2.2 22.44,19.55
  Bottom 0.254: MOD1.P$1 86.04,9.84 87,10.79 87,13.02 87.59,13.61 J7.2 J8.2 97.75,13.61 98.42,14.29 98.42,24.13 97.79,24.77 MOD4.P$1
+5V  (9 unrouted)
+24V  (via drill 0.5)
  Top 1.27: R10.2 11.75,65.78 v11.75,63.82
  Bottom 1.27: v11.75,63.82 11.75,73.66 14.92,76.83 19.05,76.83 | 19.05,76.83 21.91,76.83 | 21.91,76.83 IC4.1 | C12.1 21.91,76.83 | C14.1 19.05,76.83
+24V2  (via drill 0.35)  (1 unrouted)
  Top 0.152: 12.26,13.14 R1.1 | 12.26,28.39 R4.1
  Top 0.508: 13.97,43.62 v13.97,41.91 13.97,36.01 | 13.97,28.39 v13.97,34.29 13.97,36.01 | 13.97,28.39 v13.97,26.67 13.97,20.77 | 13.97,13.14 v13.97,19.05 13.97,20.77 | R16.1 13.97,43.62 | R15.1 13.97,36.01 | R4.1 13.97,28.39 | R2.1 13.97,20.77 | R1.1 13.97,13.14 | 13.97,13.14 v13.97,11.43 | 3.97,65.88 X1.1 7.14,65.88 7.94,66.67 7.94,67.63 9.65,69.34 R10.1 13.53,69.34 13.97,68.9 13.97,68.58 v13.97,67.63 13.97,54.61 | 13.97,43.62 13.97,54.61 | R6.1 13.78,54.42 13.97,54.61
  Bottom 0.152: IC1.8 v13.97,11.43 | IC2.8 v13.97,19.05 | IC9.8 v13.97,26.67 | IC10.8 v13.97,34.29 | IC11.8 v13.97,41.91 | IC6.8 13.97,52.7 | IC3.8 v13.97,67.63
/RESET  (3 unrouted)
ADC_REGEN_SENS  (1 unrouted)
AIN_00  (1 unrouted)
  Bottom 0.254: C16.1 R11.2
AIN_01  (1 unrouted)
  Bottom 0.254: C17.1 R12.2
AIN_02  (1 unrouted)
  Bottom 0.254: C18.1 R13.2
AIN_03  (1 unrouted)
  Bottom 0.254: C19.1 R14.2
AIN_04  (1 unrouted)
  Bottom 0.254: C47.1 R18.2
AIN_05  (1 unrouted)
  Bottom 0.254: C48.1 R19.2
AIN_06  (2 unrouted)
CURR_ALERT_CHRG  (via drill 0.35)
  Top 0.152: IC8.4 33.04,40.94 29.21,44.77 v29.21,52.7
  Bottom 0.152: v29.21,52.7 IC6.3
CURR_ALERT_M1  (via drill 0.35)
  Top 0.152: IC8.11 34.58,37.44 v32.38,35.24
  Bottom 0.152: IC1.3 29.21,11.43 31.11,13.34 31.11,33.97 v32.38,35.24
CURR_ALERT_M2  (via drill 0.35)
  Top 0.152: IC8.10 33.17,37.94 v31.43,36.2
  Bottom 0.152: IC2.3 28.89,19.05 30.48,20.64 30.48,35.24 v31.43,36.2
CURR_ALERT_M3  (via drill 0.35)
  Top 0.152: IC8.9 31.77,38.44 v30.48,37.15
  Bottom 0.152: IC9.3 28.57,26.67 29.53,27.62 29.53,36.2 v30.48,37.15
CURR_ALERT_M4  (via drill 0.35)
  Top 0.152: IC8.8 30.36,38.94 v29.53,38.1
  Bottom 0.152: IC10.3 27.3,34.29 28.57,35.56 28.57,37.15 v29.53,38.1 29.69,38.26
CURR_ALERT_M5  (via drill 0.35)
  Top 0.152: v31.11,40.96 31.64,40.44 IC8.5
  Bottom 0.152: IC11.3 30.16,41.91 v31.11,40.96
CURR_ALERT_SYS  (via drill 0.35)
  Top 0.152: v30.16,65.72 30.16,44.77 33.49,41.44 IC8.3
  Bottom 0.152: IC3.3 28.89,67.63 30.16,66.36 v30.16,65.72
GND  (52 unrouted)
  Bottom 0.152: IC1.1 26.3,12.43 26.35,12.38 26.35,12.06 26.22,11.93 IC1.2
GNDA  (12 unrouted)
I2C_0_SCL  (via drill 0.5)
  Top 0.254: IC8.47 53.63,40.98 54.93,39.69 v55.24,40.01 | J8.3 94.69,16.11 93.66,17.14 93.66,28.89 95.89,31.11 MOD4.P$3
  Bottom 0.254: v55.24,40.01 64.45,40.01 68.26,36.2 MOD2.P$4 87.63,36.2 92.71,31.11 MOD4.P$3 | MOD1.P$4 86.04,17.46 87.39,16.11 J7.3 J8.3
I2C_0_SDA  (via drill 0.5)
  Top 0.254: IC8.46 54.13,42.39 v55.24,41.27 | J8.4 95.69,18.61 94.61,19.68 94.61,28.26 96.2,29.84 99.06,29.84 99.69,30.48 99.69,33.34 99.38,33.66 MOD4.P$4
  Bottom 0.254: v55.24,41.27 65.41,41.27 67.94,38.73 77.15,38.73 79.69,41.27 MOD2.P$6 85.41,41.27 93.03,33.66 MOD4.P$4 | MOD1.P$5 86.04,20 87.43,18.61 J7.4 J8.4
I2C_1_SCL  (via drill 0.35)  (1 unrouted)
  Top 0.152: v26.99,50.8 v26.99,40.01 v26.99,35.24 v26.99,32.38 v26.99,24.77 v26.99,17.14 v26.99,9.53 | IC8.7 30.41,39.44 29.84,40.01 v28.89,40.01
  Top 0.203: v26.99,50.8 v26.99,65.72
  Bottom 0.152: v26.99,9.53 25.4,9.53 25.06,9.87 IC1.5 | v26.99,50.8 25.4,50.8 25.06,51.14 IC6.5 | v26.99,32.38 25.4,32.38 25.06,32.73 IC10.5 | v26.99,24.77 25.4,24.77 25.06,25.11 IC9.5 | v26.99,17.14 25.4,17.14 25.06,17.48 IC2.5 25.08,18.03 | v26.99,65.72 25.4,65.72 25.06,66.06 IC3.5 | IC11.5 25.06,40.34 25.4,40.01 v26.99,40.01 v28.89,40.01 | IC10.2 26.54,34.79 v26.99,35.24
I2C_1_SDA  (via drill 0.35)  (1 unrouted)
  Top 0.152: v27.94,10.48 v27.94,18.1 v27.94,25.72 v27.94,27.62 v27.94,33.34 v27.94,40.96 | v27.94,40.96 v27.94,51.75 | IC8.6 30.86,39.94 29.84,40.96 v27.94,40.96
  Top 0.203: v27.94,51.75 v27.94,53.34 v27.94,66.67
  Bottom 0.152: v27.94,10.48 27.49,10.93 IC1.4 | v27.94,51.75 27.49,52.2 IC6.4 | v27.94,40.96 27.49,41.41 IC11.4 | v27.94,33.34 27.49,33.79 IC10.4 | v27.94,25.72 27.49,26.17 IC9.4 | v27.94,18.1 27.49,18.55 IC2.4 | v27.94,66.67 27.49,67.13 IC3.4 | IC6.2 27.8,53.2 v27.94,53.34 | IC9.2 27.49,27.17 v27.94,27.62
N$1
  Top 0.152: 3.94,9.71 M1.1
  Top 0.508: R1.2 3.94,9.71
N$2
  Top 0.508: R2.2 11.88,17.3 M2.1
N$3
  Top 0.508: R4.2 11.88,24.92 M3.1
N$4  (3 unrouted)
N$5  (3 unrouted)
N$6  (via drill 0.35)
  Top 0.203: 16.07,18.61 R2.4 16.07,18.61 | 16.07,18.61 16.51,19.05 17.78,19.05 18.41,19.68 v18.41,20.32
  Bottom 0.203: v18.41,20.32 18.41,19.68 18.55,19.55 IC2.9
N$7  (via drill 0.35)
  Top 0.203: v18.41,12.7 18.41,12.06 17.78,11.43 16.51,11.43 16.07,10.98 R1.4
  Bottom 0.203: v18.41,12.7 18.41,12.06 18.55,11.93 IC1.9
N$8  (via drill 0.35)
  Top 0.203: R1.3 16.51,13.59 16.51,13.97 v18.41,13.97
  Bottom 0.203: IC1.10 20.66,12.99 19.68,13.97 v18.41,13.97
N$9  (via drill 0.35)
  Top 0.203: v18.41,53.98 18.41,53.34 17.78,52.7 16.51,52.7 16.07,52.26 16.07,52.07 R6.4
  Bottom 0.203: v18.41,53.98 18.41,53.34 18.55,53.2 IC6.9
N$10  (via drill 0.35)
  Top 0.203: R2.3 16.07,21.59 v18.41,21.59
  Bottom 0.203: v18.41,21.59 19.68,21.59 20.66,20.61 IC2.10
N$11  (via drill 0.35)
  Top 0.203: R6.3 16.51,54.87 16.51,55.24 v18.41,55.24
  Bottom 0.203: v18.41,55.24 19.68,55.24 20.66,54.27 IC6.10
N$12
  Top 0.508: R6.2 6.16,50.99 3.91,53.24 BATT.1
N$13  (1 unrouted)
N$14  (1 unrouted)
N$15
  Bottom 0.254: R12.1 50.16,3.93 J2.4
N$16  (1 unrouted)
N$17
  Bottom 0.254: R13.1 52.7,3.97 J2.5
N$18
  Bottom 0.254: R11.1 47.62,3.89 J2.3
N$19  (1 unrouted)
N$20  (via drill 0.35)
  Top 0.203: v18.41,68.9 18.41,68.26 17.78,67.63 16.51,67.63 16.07,67.18 R10.4
  Bottom 0.203: v18.41,68.9 18.41,68.26 18.55,68.13 IC3.9
N$21  (via drill 0.35)
  Top 0.203: R10.3 16.51,69.79 16.51,70.17 v18.41,70.17
  Bottom 0.203: v18.41,70.17 19.68,70.17 20.66,69.19 IC3.10
N$22
  Top 0.152: 3.94,32.58 M4.1
  Top 0.508: R15.2 3.94,32.58
N$23  (1 unrouted)
N$24
  Bottom 0.254: R18.1 68.58,3.93 J3.4
N$25  (via drill 0.35)
  Top 0.203: 16.07,33.84 R15.4 16.07,33.84 | 16.07,33.84 16.51,34.29 17.78,34.29 18.41,34.92 v18.41,35.56
  Bottom 0.203: v18.41,35.56 18.41,34.92 18.55,34.79 IC10.9
N$26
  Bottom 0.254: R19.1 71.12,3.97 J3.5
N$27  (via drill 0.35)
  Top 0.203: 16.07,26.23 R4.4 16.07,26.23 | 16.07,26.23 16.51,26.67 17.78,26.67 18.41,27.3 v18.41,27.94
  Bottom 0.203: v18.41,27.94 18.41,27.3 18.55,27.17 IC9.9
N$28
  Bottom 0.254: R14.1 66.04,3.89 J3.3
N$29  (via drill 0.35)
  Top 0.203: R4.3 16.51,28.83 16.51,29.21 v18.41,29.21
  Bottom 0.203: IC9.10 20.66,28.23 19.68,29.21 19.05,29.21 v18.41,29.21
N$30  (1 unrouted)
N$31  (via drill 0.35)
  Top 0.203: R15.3 16.89,36.83 v18.41,36.83
  Bottom 0.203: IC10.10 20.66,35.85 19.68,36.83 19.05,36.83 v18.41,36.83
N$32
  Top 0.152: 3.94,40.2 M5.1
  Top 0.508: R16.2 3.94,40.2
N$33  (via drill 0.35)
  Top 0.203: 16.07,41.47 R16.4 16.07,41.47 | 16.07,41.47 16.51,41.91 17.78,41.91 18.41,42.55 v18.41,43.18
  Bottom 0.203: v18.41,43.18 18.41,42.55 18.55,42.41 IC11.9
N$34  (via drill 0.35)
  Top 0.203: R16.3 16.51,44.07 16.51,44.45 v18.41,44.45
  Bottom 0.203: v18.41,44.45 19.68,44.45 20.66,43.48 IC11.10
N$35  (1 unrouted)
N$36  (1 unrouted)
N$38  (1 unrouted)
N$40  (1 unrouted)
N$41  (1 unrouted)
N$42  (1 unrouted)
N$43  (1 unrouted)
N$44  (1 unrouted)
N$45  (1 unrouted)
N$46  (1 unrouted)
N$47  (1 unrouted)
N$48  (1 unrouted)
PWM_PCA9685_OE  (1 unrouted)
  Top 0.152: IC8.12 35.67,36.94 30.48,31.75
UART_0_RXD
  Top 0.254: IC8.45 54.63,46.38 60.64,52.39 GPS.2
UART_0_TXD
  Top 0.254: IC8.44 55.13,45.6 59.37,49.85 GPS.1